# EAGLE design boden2021_V35 (EAGLE 9.6.1)
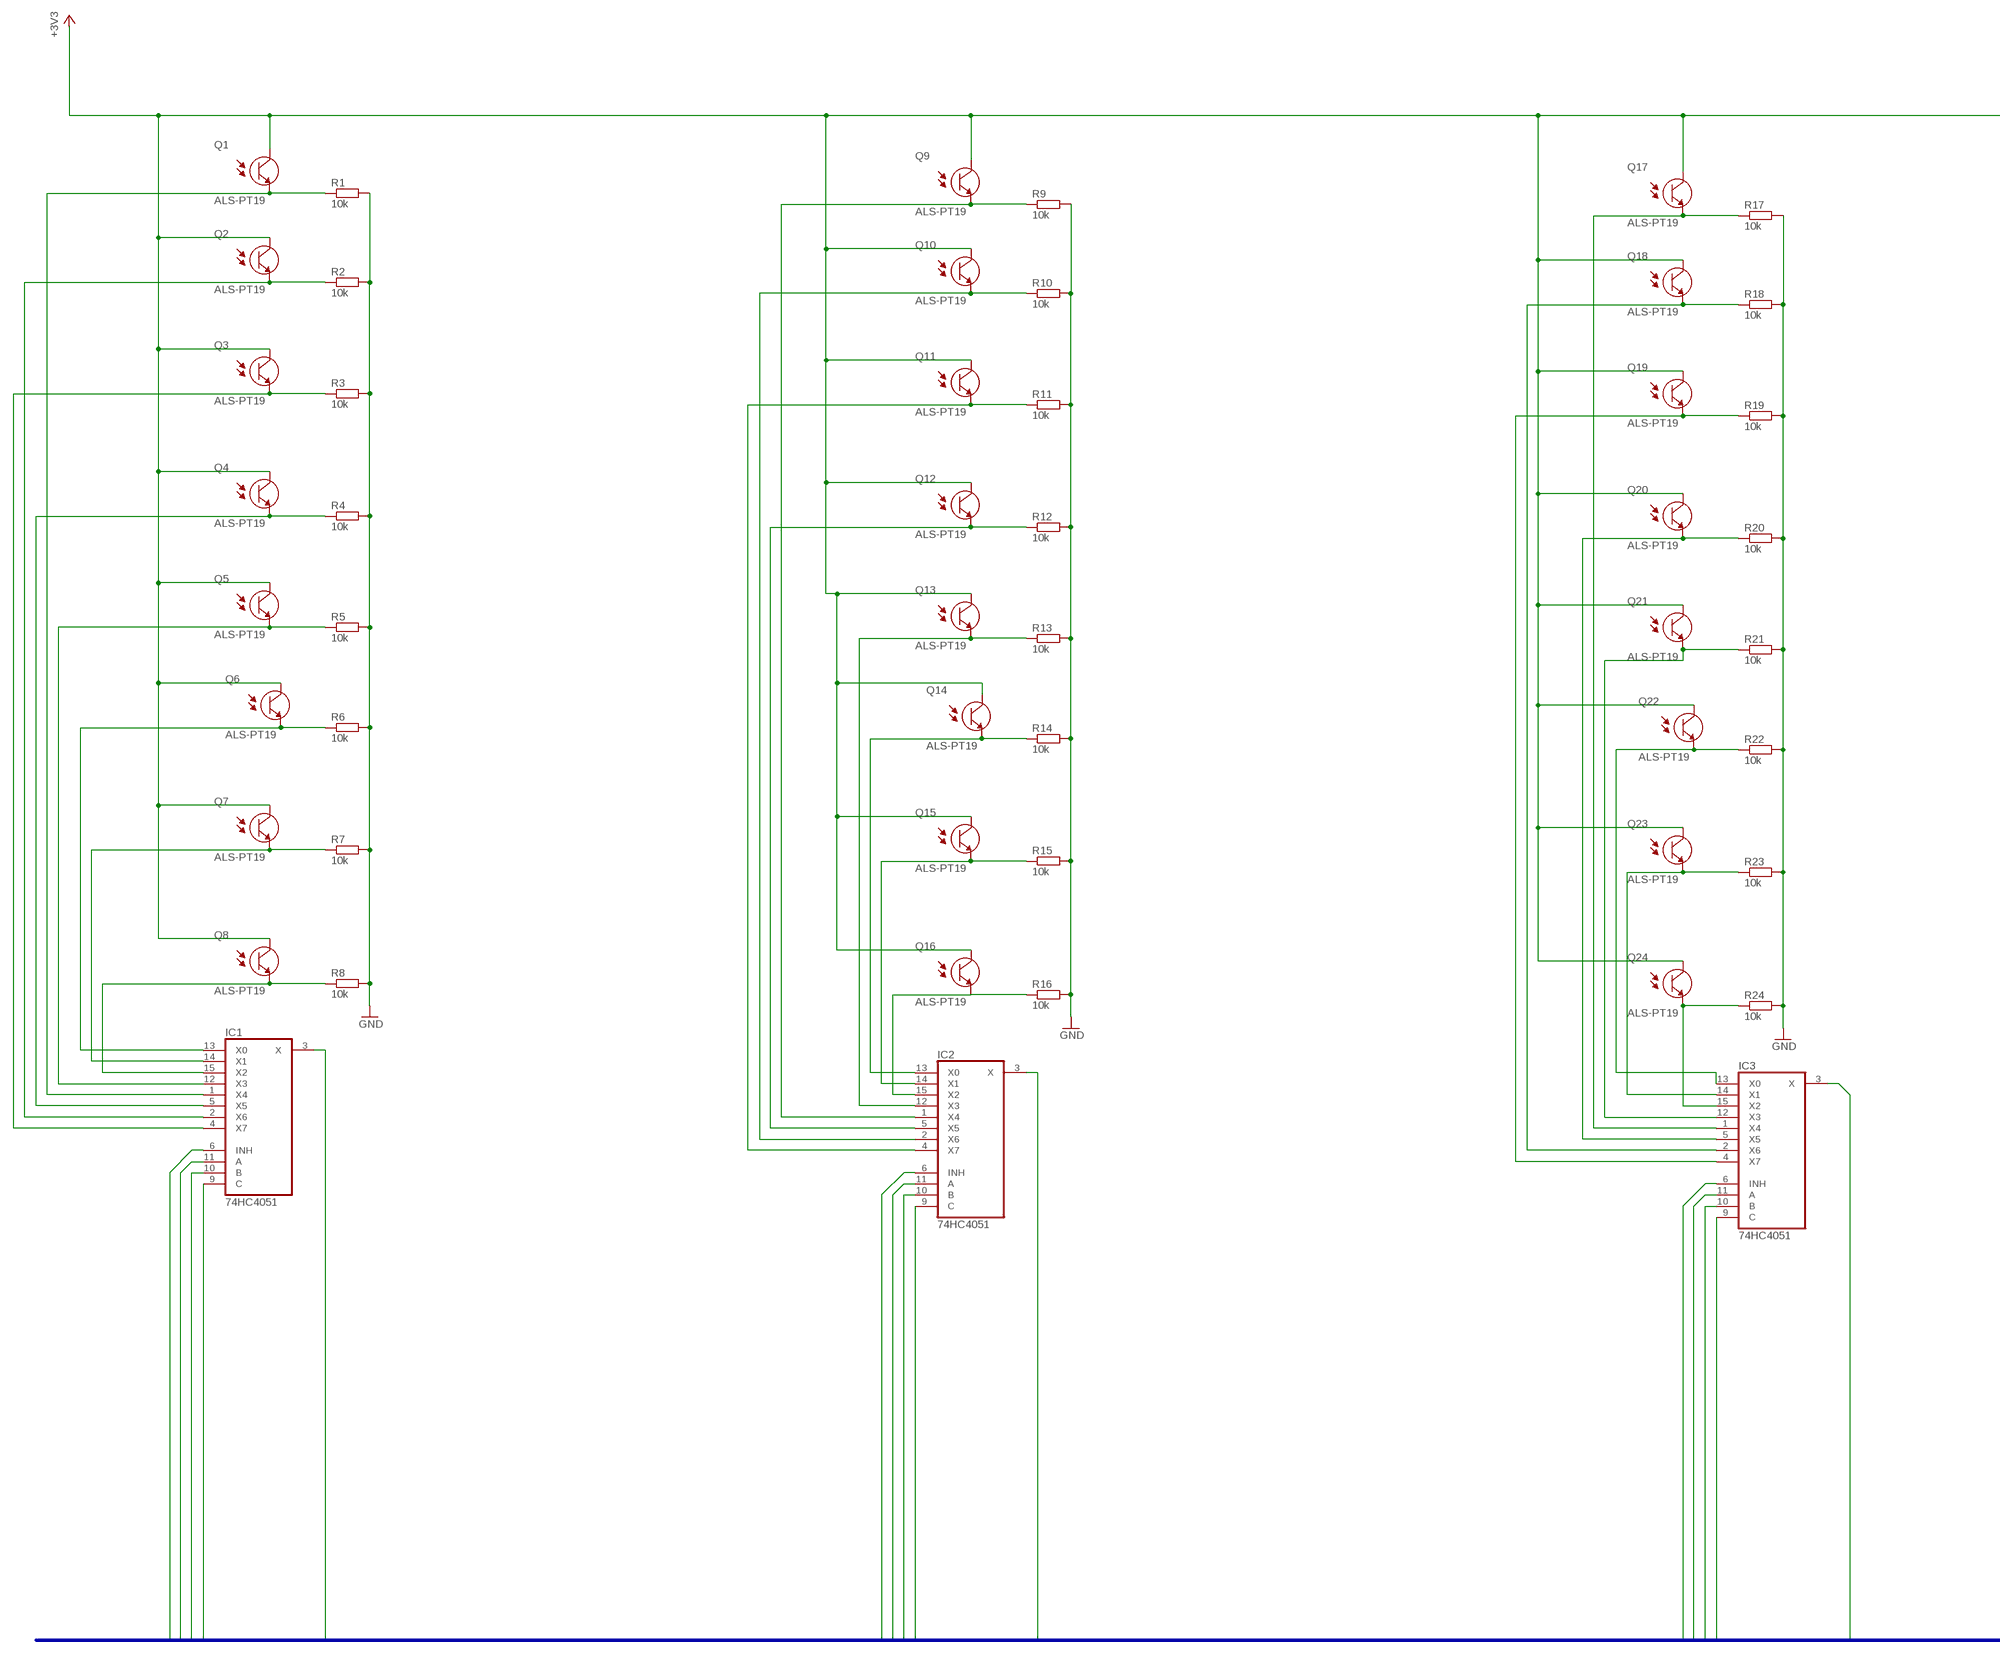
[diagram p0: schematic, sheet 1, part 1 of 3]
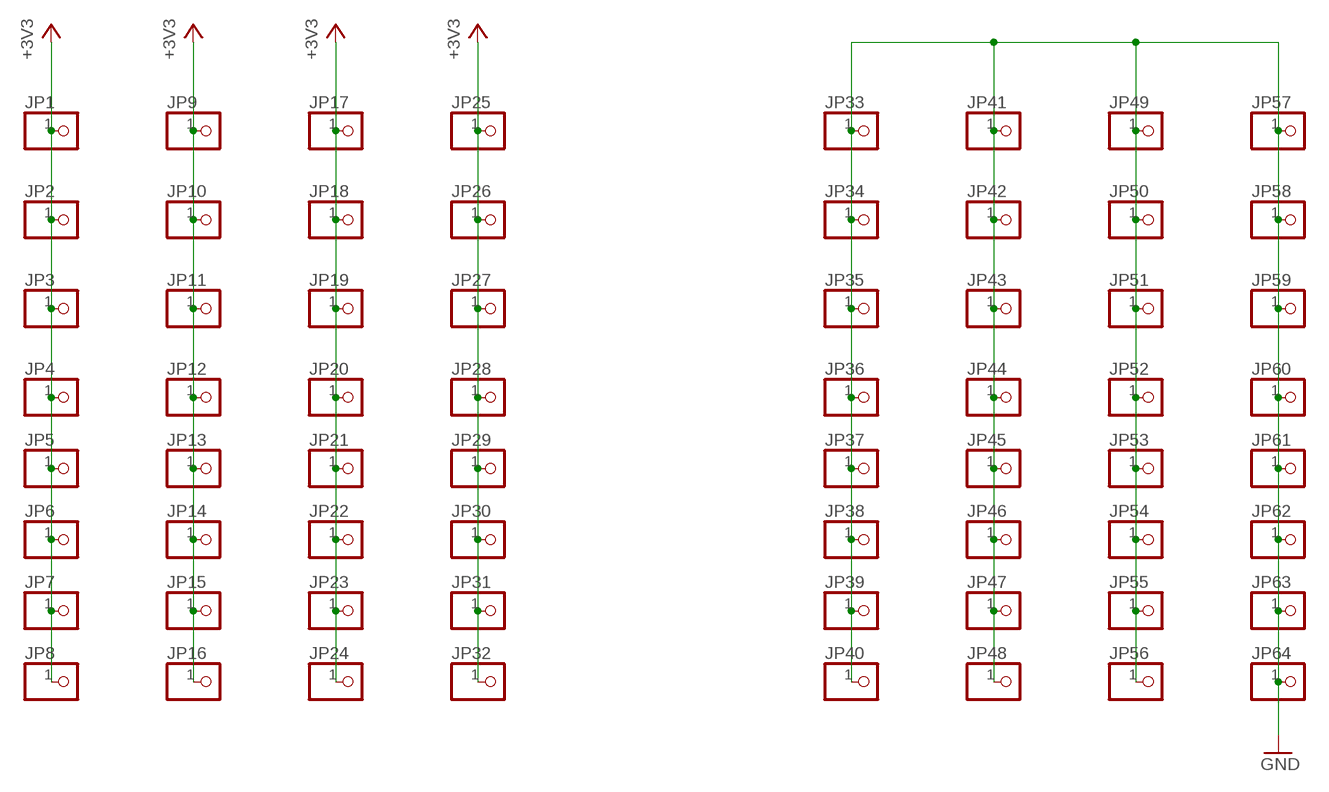
[diagram p1: schematic, sheet 1, part 2 of 3]
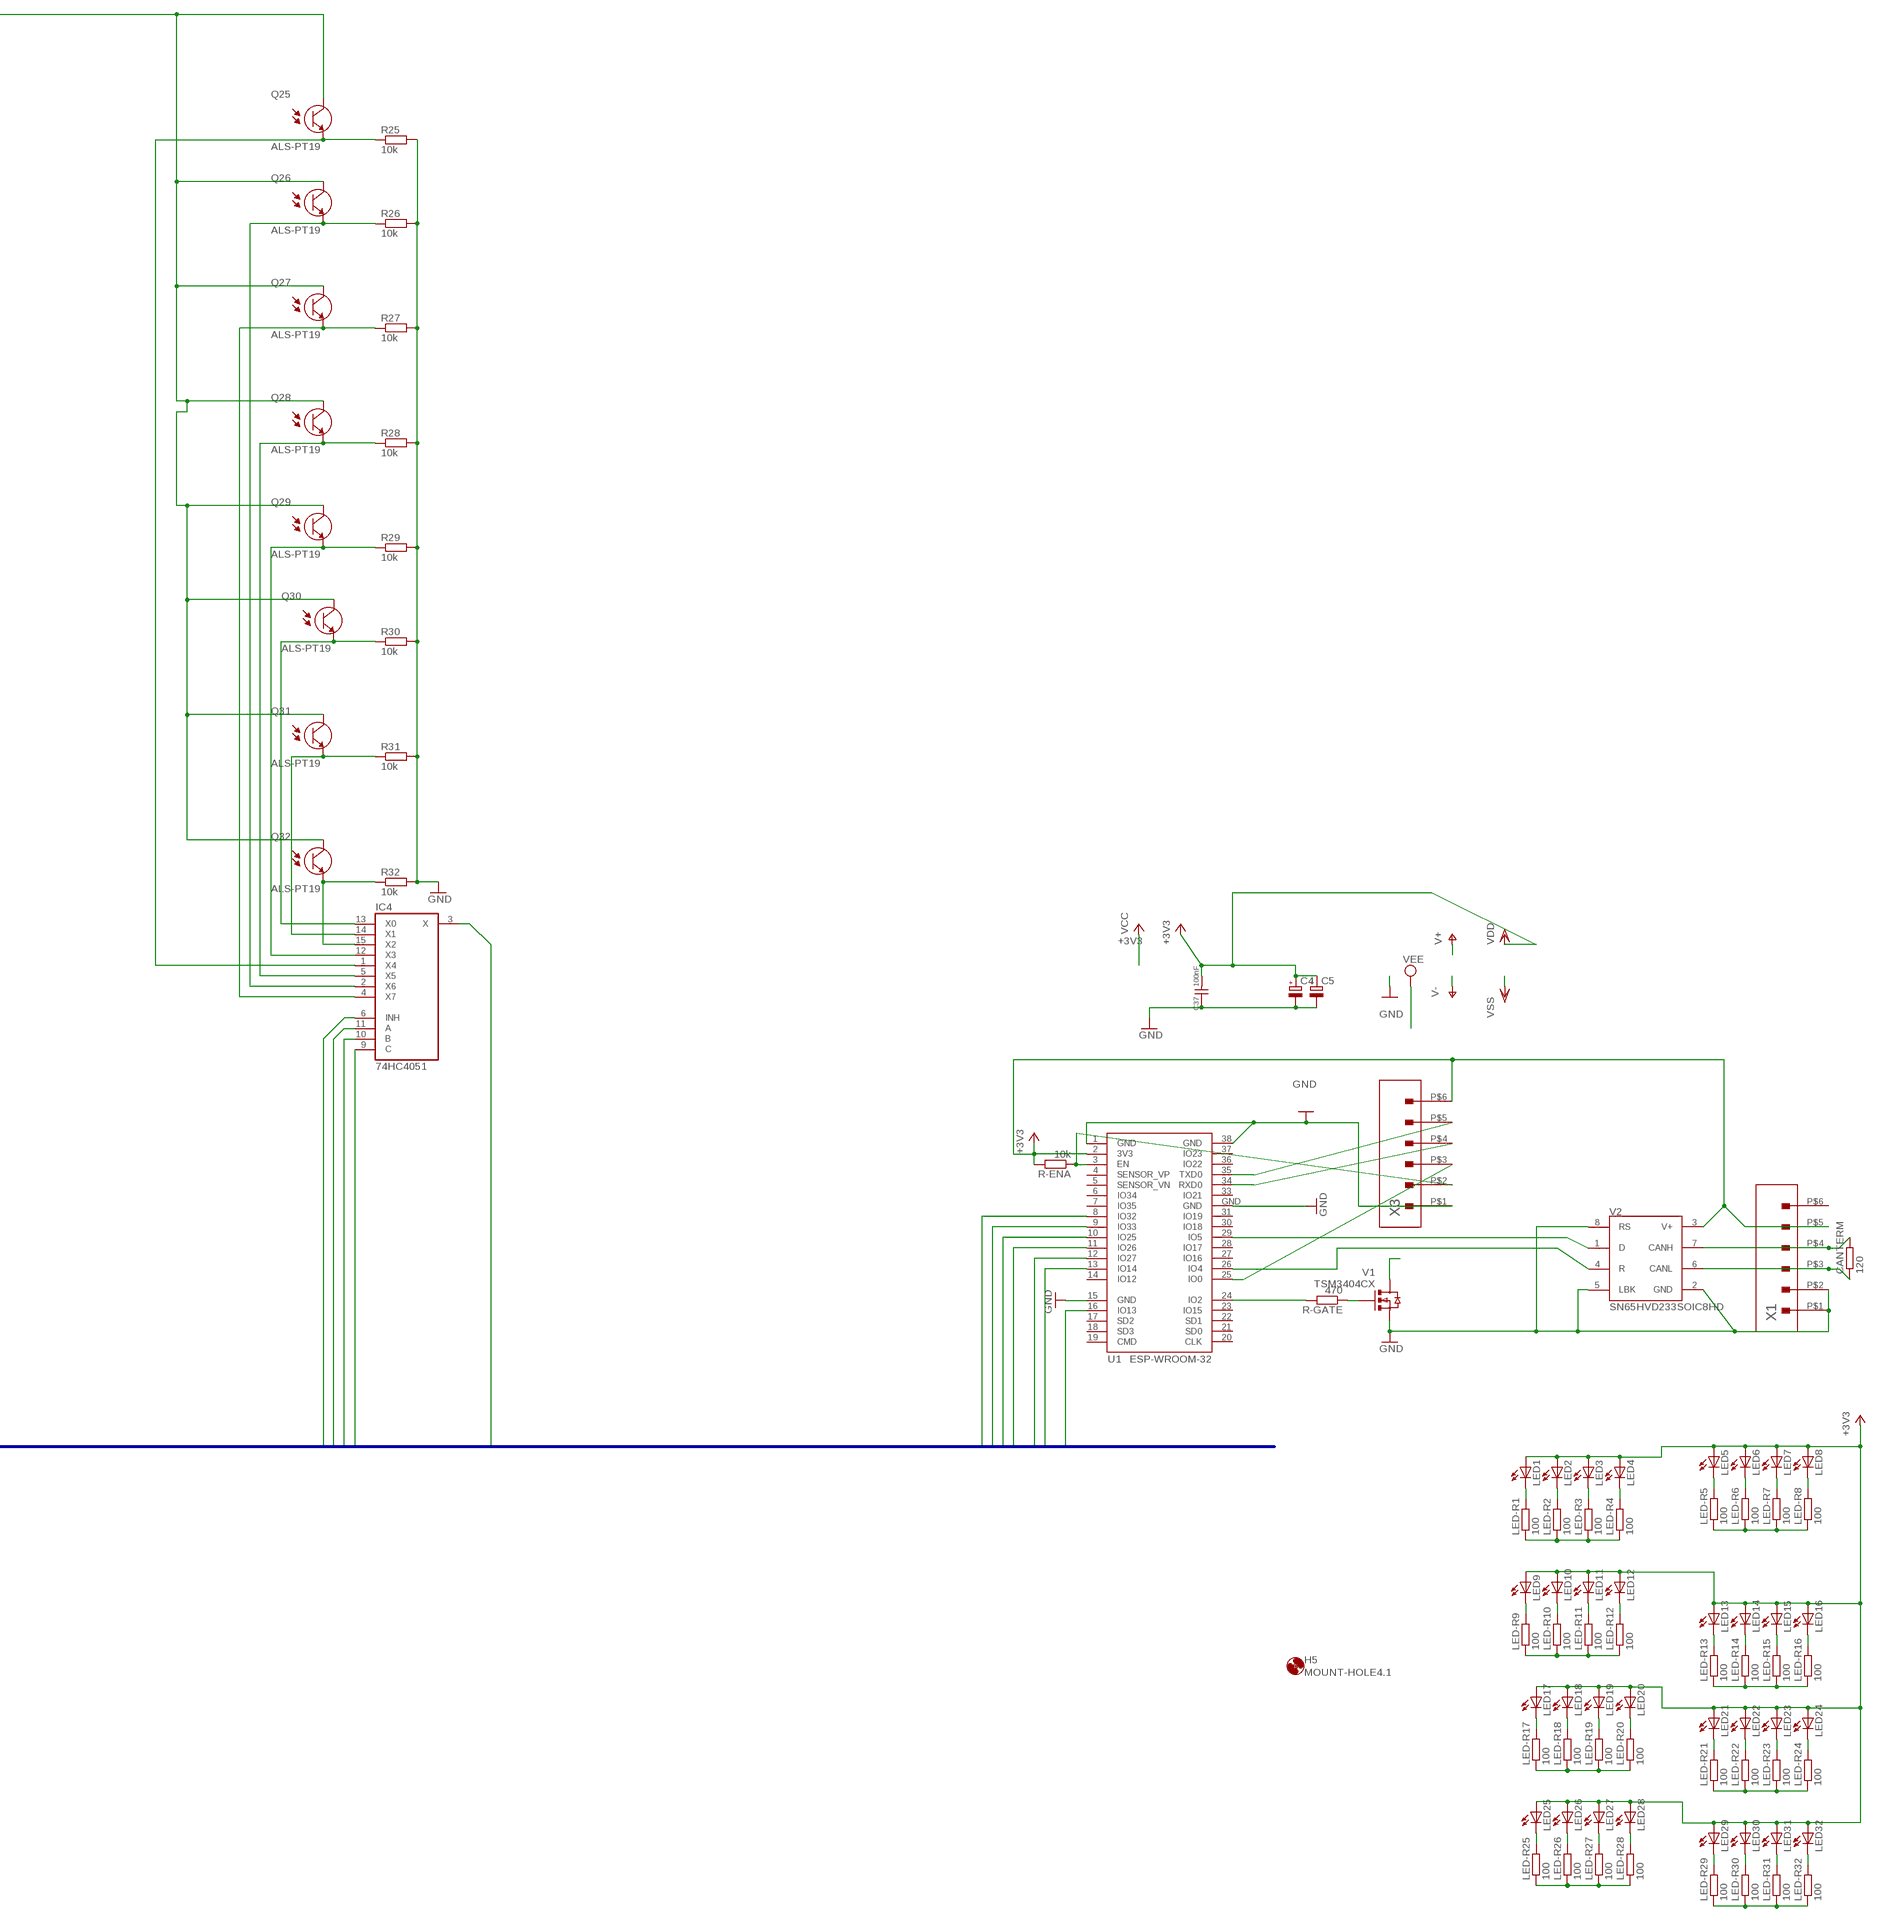
[diagram p2: schematic, sheet 1, part 3 of 3]

## Parts
C4  CPOL-EUE2,5-6E  [E2,5-6E]
C5  CPOL-EUE2,5-6E  [E2,5-6E]
C37  100nF  C0805  [0805]
CANTERM  120  R-EU_R0603  [R0603]
H5  MOUNT-HOLE4.1  [4,1]
IC1  74HC4051  4051  [TSSOP-16]
IC2  74HC4051  4051  [TSSOP-16]
IC3  74HC4051  4051  [TSSOP-16]
IC4  74HC4051  4051  [TSSOP-16]
JP1  PINHD-1X1  [1X01]
JP2  PINHD-1X1  [1X01]
JP3  PINHD-1X1  [1X01]
JP4  PINHD-1X1  [1X01]
JP5  PINHD-1X1  [1X01]
JP6  PINHD-1X1  [1X01]
JP7  PINHD-1X1  [1X01]
JP8  PINHD-1X1  [1X01]
JP9  PINHD-1X1  [1X01]
JP10  PINHD-1X1  [1X01]
JP11  PINHD-1X1  [1X01]
JP12  PINHD-1X1  [1X01]
JP13  PINHD-1X1  [1X01]
JP14  PINHD-1X1  [1X01]
JP15  PINHD-1X1  [1X01]
JP16  PINHD-1X1  [1X01]
JP17  PINHD-1X1  [1X01]
JP18  PINHD-1X1  [1X01]
JP19  PINHD-1X1  [1X01]
JP20  PINHD-1X1  [1X01]
JP21  PINHD-1X1  [1X01]
JP22  PINHD-1X1  [1X01]
JP23  PINHD-1X1  [1X01]
JP24  PINHD-1X1  [1X01]
JP25  PINHD-1X1  [1X01]
JP26  PINHD-1X1  [1X01]
JP27  PINHD-1X1  [1X01]
JP28  PINHD-1X1  [1X01]
JP29  PINHD-1X1  [1X01]
JP30  PINHD-1X1  [1X01]
JP31  PINHD-1X1  [1X01]
JP32  PINHD-1X1  [1X01]
JP33  PINHD-1X1  [1X01]
JP34  PINHD-1X1  [1X01]
JP35  PINHD-1X1  [1X01]
JP36  PINHD-1X1  [1X01]
JP37  PINHD-1X1  [1X01]
JP38  PINHD-1X1  [1X01]
JP39  PINHD-1X1  [1X01]
JP40  PINHD-1X1  [1X01]
JP41  PINHD-1X1  [1X01]
JP42  PINHD-1X1  [1X01]
JP43  PINHD-1X1  [1X01]
JP44  PINHD-1X1  [1X01]
JP45  PINHD-1X1  [1X01]
JP46  PINHD-1X1  [1X01]
JP47  PINHD-1X1  [1X01]
JP48  PINHD-1X1  [1X01]
JP49  PINHD-1X1  [1X01]
JP50  PINHD-1X1  [1X01]
JP51  PINHD-1X1  [1X01]
JP52  PINHD-1X1  [1X01]
JP53  PINHD-1X1  [1X01]
JP54  PINHD-1X1  [1X01]
JP55  PINHD-1X1  [1X01]
JP56  PINHD-1X1  [1X01]
JP57  PINHD-1X1  [1X01]
JP58  PINHD-1X1  [1X01]
JP59  PINHD-1X1  [1X01]
JP60  PINHD-1X1  [1X01]
JP61  PINHD-1X1  [1X01]
JP62  PINHD-1X1  [1X01]
JP63  PINHD-1X1  [1X01]
JP64  PINHD-1X1  [1X01]
LED1  LEDP-LCC-2  [P-LCC-2]
LED2  LEDP-LCC-2  [P-LCC-2]
LED3  LEDP-LCC-2  [P-LCC-2]
LED4  LEDP-LCC-2  [P-LCC-2]
LED5  LEDP-LCC-2  [P-LCC-2]
LED6  LEDP-LCC-2  [P-LCC-2]
LED7  LEDP-LCC-2  [P-LCC-2]
LED8  LEDP-LCC-2  [P-LCC-2]
LED9  LEDP-LCC-2  [P-LCC-2]
LED10  LEDP-LCC-2  [P-LCC-2]
LED11  LEDP-LCC-2  [P-LCC-2]
LED12  LEDP-LCC-2  [P-LCC-2]
LED13  LEDP-LCC-2  [P-LCC-2]
LED14  LEDP-LCC-2  [P-LCC-2]
LED15  LEDP-LCC-2  [P-LCC-2]
LED16  LEDP-LCC-2  [P-LCC-2]
LED17  LEDP-LCC-2  [P-LCC-2]
LED18  LEDP-LCC-2  [P-LCC-2]
LED19  LEDP-LCC-2  [P-LCC-2]
LED20  LEDP-LCC-2  [P-LCC-2]
LED21  LEDP-LCC-2  [P-LCC-2]
LED22  LEDP-LCC-2  [P-LCC-2]
LED23  LEDP-LCC-2  [P-LCC-2]
LED24  LEDP-LCC-2  [P-LCC-2]
LED25  LEDP-LCC-2  [P-LCC-2]
LED26  LEDP-LCC-2  [P-LCC-2]
LED27  LEDP-LCC-2  [P-LCC-2]
LED28  LEDP-LCC-2  [P-LCC-2]
LED29  LEDP-LCC-2  [P-LCC-2]
LED30  LEDP-LCC-2  [P-LCC-2]
LED31  LEDP-LCC-2  [P-LCC-2]
LED32  LEDP-LCC-2  [P-LCC-2]
LED-R1  100  R-EU_R0805  [R0805]
LED-R2  100  R-EU_R0805  [R0805]
LED-R3  100  R-EU_R0805  [R0805]
LED-R4  100  R-EU_R0805  [R0805]
LED-R5  100  R-EU_R0805  [R0805]
LED-R6  100  R-EU_R0805  [R0805]
LED-R7  100  R-EU_R0805  [R0805]
LED-R8  100  R-EU_R0805  [R0805]
LED-R9  100  R-EU_R0805  [R0805]
LED-R10  100  R-EU_R0805  [R0805]
LED-R11  100  R-EU_R0805  [R0805]
LED-R12  100  R-EU_R0805  [R0805]
LED-R13  100  R-EU_R0805  [R0805]
LED-R14  100  R-EU_R0805  [R0805]
LED-R15  100  R-EU_R0805  [R0805]
LED-R16  100  R-EU_R0805  [R0805]
LED-R17  100  R-EU_R0805  [R0805]
LED-R18  100  R-EU_R0805  [R0805]
LED-R19  100  R-EU_R0805  [R0805]
LED-R20  100  R-EU_R0805  [R0805]
LED-R21  100  R-EU_R0805  [R0805]
LED-R22  100  R-EU_R0805  [R0805]
LED-R23  100  R-EU_R0805  [R0805]
LED-R24  100  R-EU_R0805  [R0805]
LED-R25  100  R-EU_R0805  [R0805]
LED-R26  100  R-EU_R0805  [R0805]
LED-R27  100  R-EU_R0805  [R0805]
LED-R28  100  R-EU_R0805  [R0805]
LED-R29  100  R-EU_R0805  [R0805]
LED-R30  100  R-EU_R0805  [R0805]
LED-R31  100  R-EU_R0805  [R0805]
LED-R32  100  R-EU_R0805  [R0805]
Q1  ALS-PT19  [ALSPT19315CL177TR8]
Q2  ALS-PT19  [ALSPT19315CL177TR8]
Q3  ALS-PT19  [ALSPT19315CL177TR8]
Q4  ALS-PT19  [ALSPT19315CL177TR8]
Q5  ALS-PT19  [ALSPT19315CL177TR8]
Q6  ALS-PT19  [ALSPT19315CL177TR8]
Q7  ALS-PT19  [ALSPT19315CL177TR8]
Q8  ALS-PT19  [ALSPT19315CL177TR8]
Q9  ALS-PT19  [ALSPT19315CL177TR8]
Q10  ALS-PT19  [ALSPT19315CL177TR8]
Q11  ALS-PT19  [ALSPT19315CL177TR8]
Q12  ALS-PT19  [ALSPT19315CL177TR8]
Q13  ALS-PT19  [ALSPT19315CL177TR8]
Q14  ALS-PT19  [ALSPT19315CL177TR8]
Q15  ALS-PT19  [ALSPT19315CL177TR8]
Q16  ALS-PT19  [ALSPT19315CL177TR8]
Q17  ALS-PT19  [ALSPT19315CL177TR8]
Q18  ALS-PT19  [ALSPT19315CL177TR8]
Q19  ALS-PT19  [ALSPT19315CL177TR8]
Q20  ALS-PT19  [ALSPT19315CL177TR8]
Q21  ALS-PT19  [ALSPT19315CL177TR8]
Q22  ALS-PT19  [ALSPT19315CL177TR8]
Q23  ALS-PT19  [ALSPT19315CL177TR8]
Q24  ALS-PT19  [ALSPT19315CL177TR8]
Q25  ALS-PT19  [ALSPT19315CL177TR8]
Q26  ALS-PT19  [ALSPT19315CL177TR8]
Q27  ALS-PT19  [ALSPT19315CL177TR8]
Q28  ALS-PT19  [ALSPT19315CL177TR8]
Q29  ALS-PT19  [ALSPT19315CL177TR8]
Q30  ALS-PT19  [ALSPT19315CL177TR8]
Q31  ALS-PT19  [ALSPT19315CL177TR8]
Q32  ALS-PT19  [ALSPT19315CL177TR8]
R1  10k  R-EU_R0603  [R0603]
R2  10k  R-EU_R0603  [R0603]
R3  10k  R-EU_R0603  [R0603]
R4  10k  R-EU_R0603  [R0603]
R5  10k  R-EU_R0603  [R0603]
R6  10k  R-EU_R0603  [R0603]
R7  10k  R-EU_R0603  [R0603]
R8  10k  R-EU_R0603  [R0603]
R9  10k  R-EU_R0603  [R0603]
R10  10k  R-EU_R0603  [R0603]
R11  10k  R-EU_R0603  [R0603]
R12  10k  R-EU_R0603  [R0603]
R13  10k  R-EU_R0603  [R0603]
R14  10k  R-EU_R0603  [R0603]
R15  10k  R-EU_R0603  [R0603]
R16  10k  R-EU_R0603  [R0603]
R17  10k  R-EU_R0603  [R0603]
R18  10k  R-EU_R0603  [R0603]
R19  10k  R-EU_R0603  [R0603]
R20  10k  R-EU_R0603  [R0603]
R21  10k  R-EU_R0603  [R0603]
R22  10k  R-EU_R0603  [R0603]
R23  10k  R-EU_R0603  [R0603]
R24  10k  R-EU_R0603  [R0603]
R25  10k  R-EU_R0603  [R0603]
R26  10k  R-EU_R0603  [R0603]
R27  10k  R-EU_R0603  [R0603]
R28  10k  R-EU_R0603  [R0603]
R29  10k  R-EU_R0603  [R0603]
R30  10k  R-EU_R0603  [R0603]
R31  10k  R-EU_R0603  [R0603]
R32  10k  R-EU_R0603  [R0603]
R-ENA  10k  R-EU_R0603  [R0603]
R-GATE  470  R-EU_R0603  [R0603]
U1  ESP-WROOM-32  [ESP-WROOM-32]
V1  TSM3404CX  [SOT23]
V2  SN65HVD233SOIC8HD  [SO08]
X1  MOLEX104078-0610  [MOLEX104078-0610]
X3  MOLEX104078-0610  [MOLEX104078-0610]

## Nets
+3V3: C4.+ C5.+ C37.1 JP1.1 JP2.1 JP3.1 JP4.1 JP5.1 JP6.1 JP7.1 JP8.1 JP9.1 JP10.1 JP11.1 JP12.1 JP13.1 JP14.1 JP15.1 JP16.1 JP17.1 JP18.1 JP19.1 JP20.1 JP21.1 JP22.1 JP23.1 JP24.1 JP25.1 JP26.1 JP27.1 JP28.1 JP29.1 JP30.1 JP31.1 JP32.1 LED1.A LED2.A LED3.A LED4.A LED5.A LED6.A LED7.A LED8.A LED9.A LED10.A LED11.A LED12.A LED13.A LED14.A LED15.A LED16.A LED17.A LED18.A LED19.A LED20.A LED21.A LED22.A LED23.A LED24.A LED25.A LED26.A LED27.A LED28.A LED29.A LED30.A LED31.A LED32.A Q1.1(C) Q2.1(C) Q3.1(C) Q4.1(C) Q5.1(C) Q6.1(C) Q7.1(C) Q8.1(C) Q9.1(C) Q10.1(C) Q11.1(C) Q12.1(C) Q13.1(C) Q14.1(C) Q15.1(C) Q16.1(C) Q17.1(C) Q18.1(C) Q19.1(C) Q20.1(C) Q21.1(C) Q22.1(C) Q23.1(C) Q24.1(C) Q25.1(C) Q26.1(C) Q27.1(C) Q28.1(C) Q29.1(C) Q30.1(C) Q31.1(C) Q32.1(C) R-ENA.2 U1.2(3V3) V2.3(V+) X1.P$5 X3.P$6 ; supply symbol labelled VDD, V+, VCC
A1: IC1.9(C) IC2.9(C) IC3.9(C) IC4.9(C) U1.16(IO13)
A2: IC1.10(B) IC2.10(B) IC3.10(B) IC4.10(B) U1.12(IO27)
A3: IC1.11(A) IC2.11(A) IC3.11(A) IC4.11(A) U1.13(IO14)
D1: IC2.3(X) U1.8(IO32)
D2: IC1.3(X) U1.9(IO33)
D3: IC3.3(X) U1.10(IO25)
D4: IC4.3(X) U1.11(IO26)
GND: C4.- C5.- C37.2 IC1.6(INH) IC2.6(INH) IC3.6(INH) IC4.6(INH) JP33.1 JP34.1 JP35.1 JP36.1 JP37.1 JP38.1 JP39.1 JP40.1 JP41.1 JP42.1 JP43.1 JP44.1 JP45.1 JP46.1 JP47.1 JP48.1 JP49.1 JP50.1 JP51.1 JP52.1 JP53.1 JP54.1 JP55.1 JP56.1 JP57.1 JP58.1 JP59.1 JP60.1 JP61.1 JP62.1 JP63.1 JP64.1 R1.2 R2.2 R3.2 R4.2 R5.2 R6.2 R7.2 R8.2 R9.2 R10.2 R11.2 R12.2 R13.2 R14.2 R15.2 R16.2 R17.2 R18.2 R19.2 R20.2 R21.2 R22.2 R23.2 R24.2 R25.2 R26.2 R27.2 R28.2 R29.2 R30.2 R31.2 R32.2 U1.1(GND) U1.15(GND) U1.38(GND) U1.GND V1.S V2.2(GND) V2.5(LBK) V2.8(RS) X1.P$1 X1.P$2 X3.P$1 ; supply symbol labelled V-, VSS, VEE
LED: LED-R1.1 LED-R2.1 LED-R3.1 LED-R4.1 LED-R5.1 LED-R6.1 LED-R7.1 LED-R8.1 LED-R9.1 LED-R10.1 LED-R11.1 LED-R12.1 LED-R13.1 LED-R14.1 LED-R15.1 LED-R16.1 LED-R17.1 LED-R18.1 LED-R19.1 LED-R20.1 LED-R21.1 LED-R22.1 LED-R23.1 LED-R24.1 LED-R25.1 LED-R26.1 LED-R27.1 LED-R28.1 LED-R29.1 LED-R30.1 LED-R31.1 LED-R32.1 V1.D
LED-BASE: R-GATE.1 V1.G
LED-SCHALT: R-GATE.2 U1.24(IO2)
N$1: LED5.C LED-R5.2
N$2: LED6.C LED-R6.2
N$3: LED7.C LED-R7.2
N$4: LED8.C LED-R8.2
N$5: LED9.C LED-R9.2
N$6: LED10.C LED-R10.2
N$7: LED11.C LED-R11.2
N$8: LED12.C LED-R12.2
N$9: LED1.C LED-R1.2
N$10: LED2.C LED-R2.2
N$11: LED3.C LED-R3.2
N$12: LED4.C LED-R4.2
N$13: LED13.C LED-R13.2
N$14: LED14.C LED-R14.2
N$15: LED15.C LED-R15.2
N$16: LED16.C LED-R16.2
N$17: LED17.C LED-R17.2
N$18: LED18.C LED-R18.2
N$19: LED19.C LED-R19.2
N$20: LED20.C LED-R20.2
N$21: LED21.C LED-R21.2
N$22: LED22.C LED-R22.2
N$23: LED23.C LED-R23.2
N$24: LED24.C LED-R24.2
N$25: LED25.C LED-R25.2
N$26: LED26.C LED-R26.2
N$27: LED27.C LED-R27.2
N$28: LED28.C LED-R28.2
N$29: LED29.C LED-R29.2
N$30: LED30.C LED-R30.2
N$31: LED31.C LED-R31.2
N$32: LED32.C LED-R32.2
N$33: R-ENA.1 U1.3(EN) X3.P$2
N$34: IC1.13(X0) Q6.2(E) R6.1
N$35: U1.25(IO0) X3.P$3
N$36: IC3.14(X1) Q23.2(E) R23.1
N$37: IC3.13(X0) Q22.2(E) R22.1
N$38: IC1.12(X3) Q5.2(E) R5.1
N$39: IC1.14(X1) Q7.2(E) R7.1
N$40: IC1.15(X2) Q8.2(E) R8.1
N$41: IC3.12(X3) Q21.2(E) R21.1
N$42: IC4.4(X7) Q27.2(E) R27.1
N$43: IC1.1(X4) Q1.2(E) R1.1
N$44: IC1.5(X5) Q4.2(E) R4.1
N$45: IC1.2(X6) Q2.2(E) R2.1
N$46: IC1.4(X7) Q3.2(E) R3.1
N$47: IC2.15(X2) Q16.2(E) R16.1
N$48: IC2.14(X1) Q15.2(E) R15.1
N$49: IC2.13(X0) Q14.2(E) R14.1
N$50: IC2.12(X3) Q13.2(E) R13.1
N$51: IC2.1(X4) Q9.2(E) R9.1
N$52: IC2.5(X5) Q12.2(E) R12.1
N$53: IC2.4(X7) Q11.2(E) R11.1
N$54: IC2.2(X6) Q10.2(E) R10.1
N$55: IC3.15(X2) Q24.2(E) R24.1
N$56: IC4.2(X6) Q26.2(E) R26.1
N$58: IC3.1(X4) Q17.2(E) R17.1
N$59: IC3.5(X5) Q20.2(E) R20.1
N$60: IC3.2(X6) Q18.2(E) R18.1
N$61: IC3.4(X7) Q19.2(E) R19.1
N$62: IC4.15(X2) Q32.2(E) R32.1
N$63: IC4.14(X1) Q31.2(E) R31.1
N$64: IC4.13(X0) Q30.2(E) R30.1
N$65: IC4.12(X3) Q29.2(E) R29.1
N$66: IC4.1(X4) Q25.2(E) R25.1
N$67: IC4.5(X5) Q28.2(E) R28.1
N$99: U1.26(IO4) V2.4(R)
N$100: U1.29(IO5) V2.1(D)
N$101: CANTERM.2 V2.7(CANH) X1.P$4
N$102: CANTERM.1 V2.6(CANL) X1.P$3
RX: U1.34(RXD0) X3.P$4
TX: U1.35(TXD0) X3.P$5
Unconnected: U1.4(SENSOR_VP) U1.5(SENSOR_VN) U1.6(IO34) U1.7(IO35) U1.14(IO12) U1.17(SD2) U1.18(SD3) U1.19(CMD) U1.20(CLK) U1.21(SD0) U1.22(SD1) U1.23(IO15) U1.27(IO16) U1.28(IO17) U1.30(IO18) U1.31(IO19) U1.33(IO21) U1.36(IO22) U1.37(IO23) X1.P$6

## Buses
A1,A2,A3,D1,D2,D3,D4,D5,D6,D7,D8,GND

## Power pins joined to a net without a drawn wire
+3V3: IC1.16(VCC) IC2.16(VCC) IC3.16(VCC) IC4.16(VCC)
GND: IC1.7(VEE) IC1.8(GND) IC2.7(VEE) IC2.8(GND) IC3.7(VEE) IC3.8(GND) IC4.7(VEE) IC4.8(GND)

## Library data of the parts
C4 C5 = rcl:CPOL-EU: POLARIZED CAPACITOR, European symbol; SPICEPREFIX: C
C37 = KONDENSA:C0805
CANTERM LED-R1-LED-R32 = rcl:R-EU_: RESISTOR, European symbol
H5 = holes:MOUNT-HOLE: MOUNTING HOLE with drill center marker
IC1-IC4 = my40xx:4051: 8-channel ANALOG MULTIPLEXER
JP1-JP64 = pinhead:PINHD-1X1: PIN HEADER
LED1-LED32 = led:LED: LED OSRAM: - CHIPLED LG R971, LG N971, LY N971, LG Q971, LY Q971, LO R971, LY R971 LH N974, LH R974 LS Q976, LO Q976, LY Q976 LO Q996 - Hyper CHIPLED LW Q18S LB Q993, LB Q99A, LB R99A - SideLED LS A670, LO A670, LY A670, LG A670, LP A670 LB A673, LV A673, LT A673, LW A673 LH A674 LY A675 LS A676, LA A676, LO A676, LY A676, LW A676 LS A679, LY A679, LG A679 - Hyper Micro SIDELED® LS Y876, LA Y876, LO Y876, LY Y876 LT Y87S - SmartLED LW L88C, LW L88S LB L89C, LB L89S, LG L890 LS L89K, LO L89K, LY L89K LS L896, LA L896, LO L896, LY L896 - TOPLED LS T670, LO T670, LY T670, LG T670, LP T670 LSG T670, LSP T670, LSY T670, LOP T670, LYG T670 LG T671, LOG T671, LSG T671 LB T673, LV T673, LT T673, LW T673 LH T674 LS T676, LA T676, LO T676, LY T676, LB T676, LH T676, LSB T676, LW T676 LB T67C, LV T67C, LT T67C, LS T67K, LO T67K, LY T67K, LW E67C LS E67B, LA E67B, LO E67B, LY E67B, LB E67C, LV E67C, LT E67C LW T67C LS T679, LY T679, LG T679 LS T770, LO T770, LY T770, LG T770, LP T770 LB T773, LV T773, LT T773, LW T773 LH T774 LS E675, LA E675, LY E675, LS T675 LS T776, LA T776, LO T776, LY T776, LB T776 LHGB T686 LT T68C, LB T68C - Hyper Mini TOPLED® LB M676 - Mini TOPLED Santana® LG M470 LS M47K, LO M47K, LY M47K Source: http://www.osram.convergy.de LUXEON: - LUMILED® LXK2-PW12-R00, LXK2-PW12-S00, LXK2-PW14-U00, LXK2-PW14-V00 LXK2-PM12-R00, LXK2-PM12-S00, LXK2-PM14-U00 LXK2-PE12-Q00, LXK2-PE12-R00, LXK2-PE12-S00, LXK2-PE14-T00, LXK2-PE14-U00 LXK2-PB12-K00, LXK2-PB12-L00, LXK2-PB12-M00, LXK2-PB14-N00, LXK2-PB14-P00, LXK2-PB14-Q00 LXK2-PR12-L00, LXK2-PR12-M00, LXK2-PR14-Q00, LXK2-PR14-R00 LXK2-PD12-Q00, LXK2-PD12-R00, LXK2-PD12-S00 LXK2-PH12-R00, LXK2-PH12-S00 LXK2-PL12-P00, LXK2-PL12-Q00, LXK2-PL12-R00 Source: www.luxeon.com KINGBRIGHT: KA-3528ASYC Source: www.kingbright.com
Q1-Q32 = als-pt19_stie:ALS-PT19
R1-R32 R-GATE = rcl:R-EU_: RESISTOR, European symbol; SPICEPREFIX: R
R-ENA = rcl@1:R-EU_: RESISTOR, European symbol; SPICEPREFIX: R
U1 = esp32:ESP-WROOM-32: Espressif Systems ESP-WROOM-32
V1 = Mos_smd:TSM3404CX: N-Channel, 30V, 5,8A, 0,028R, Gate: 3V
V2 = Treiber:SN65HVD233: CAN Transceiver, 3,3V
X1 X3 = Roboter:MOLEX104078-0610

## Board
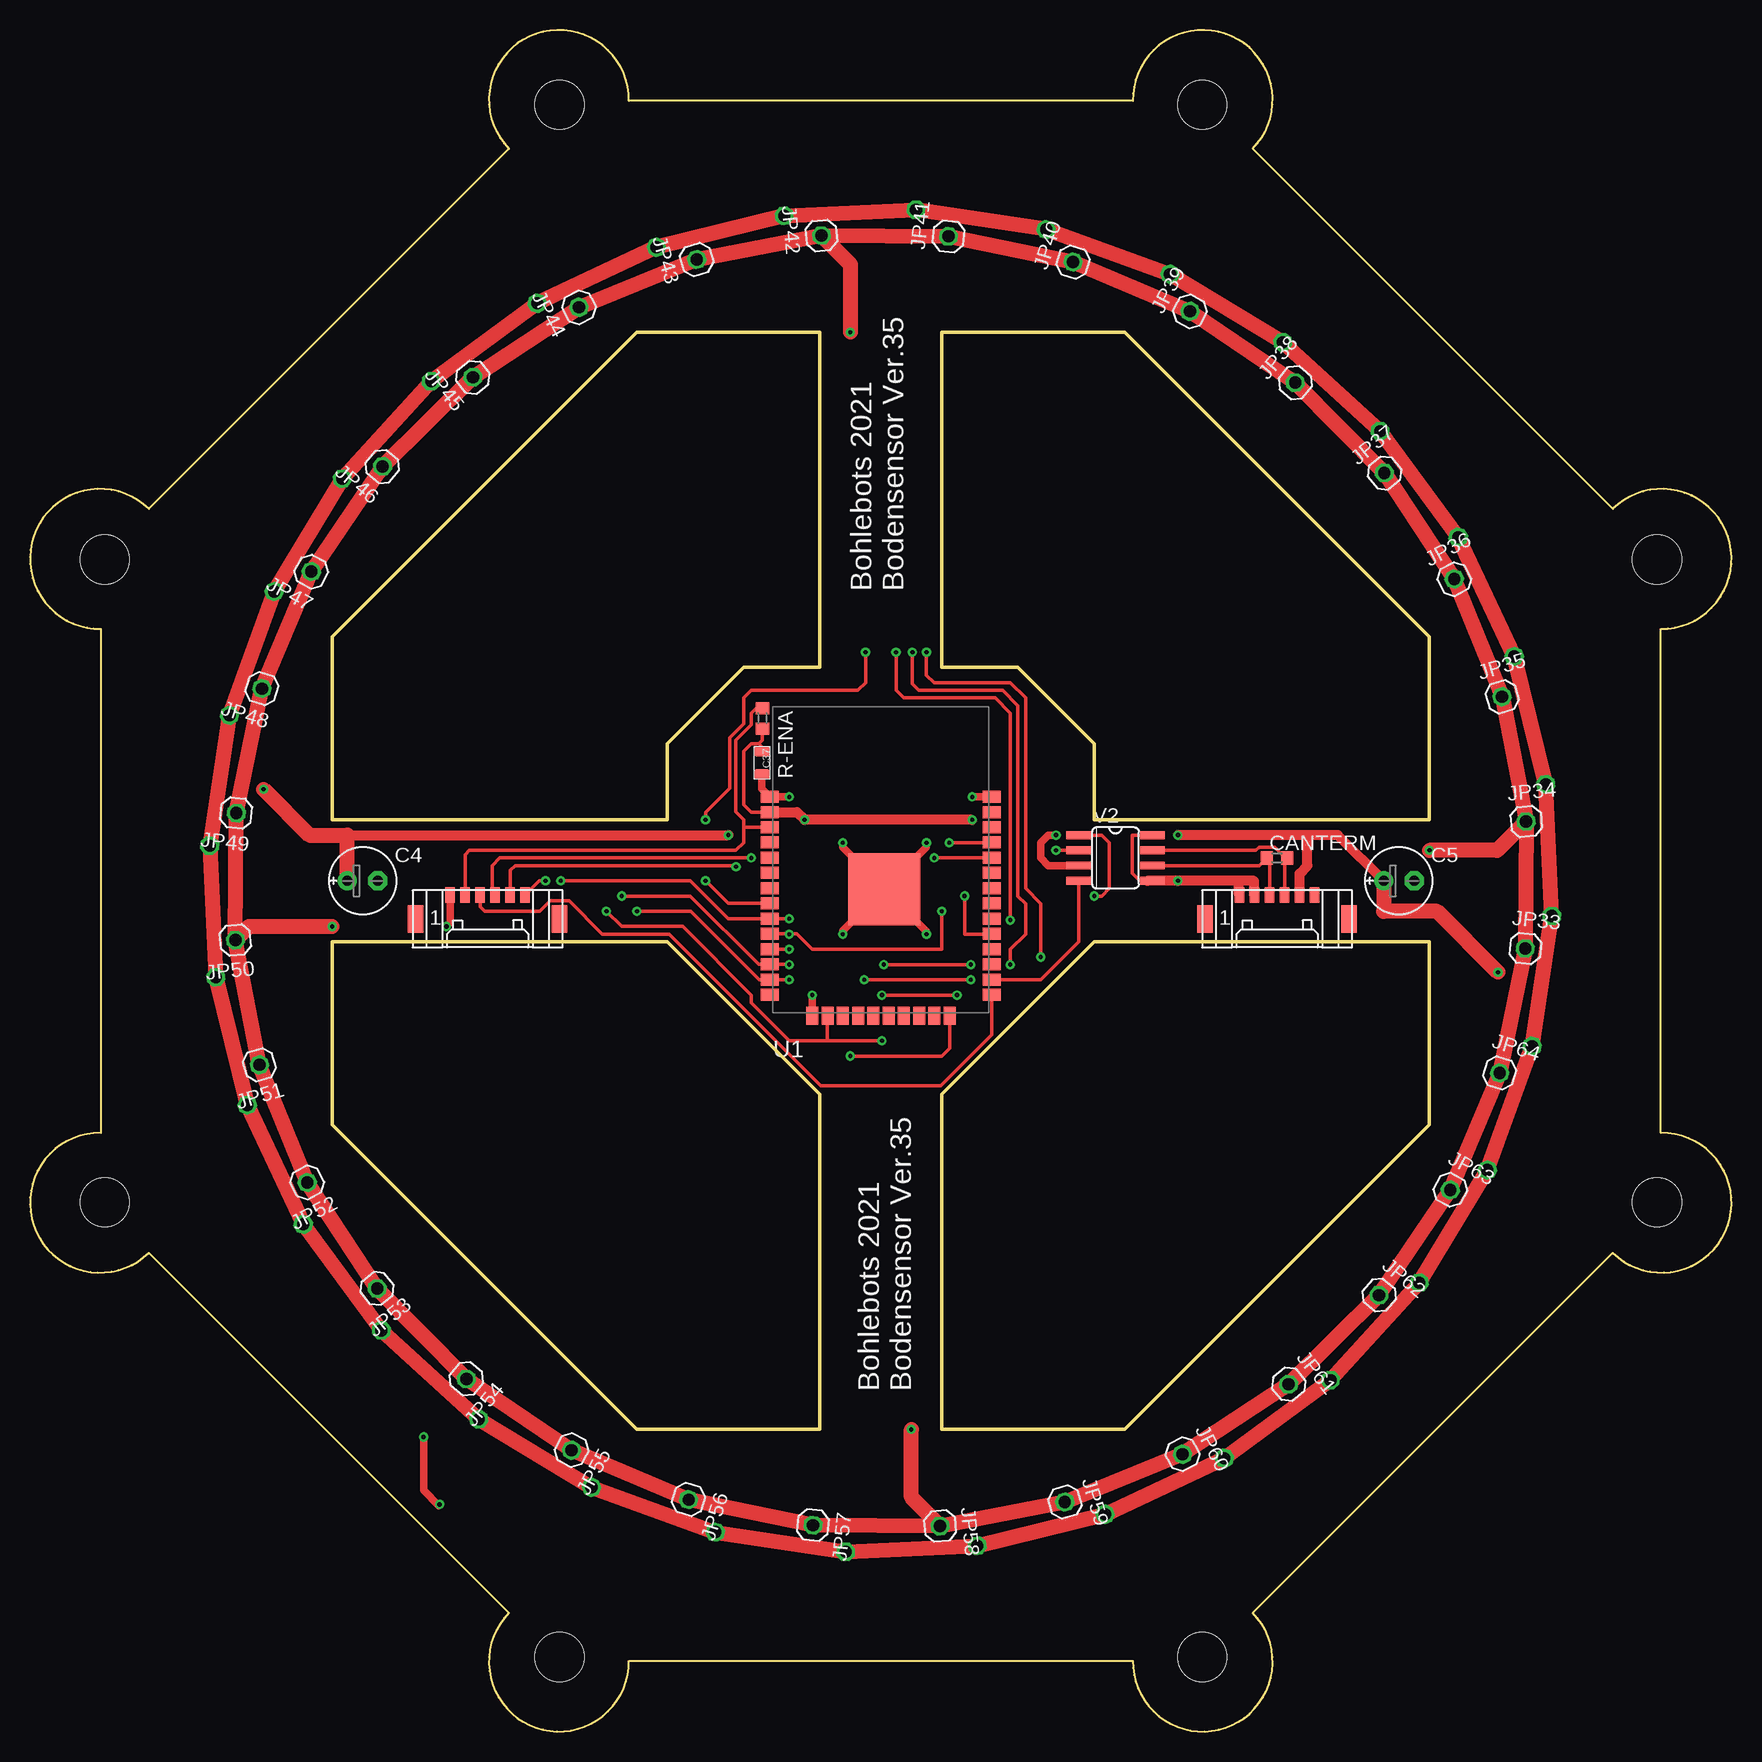
[diagram p3: board, top side]
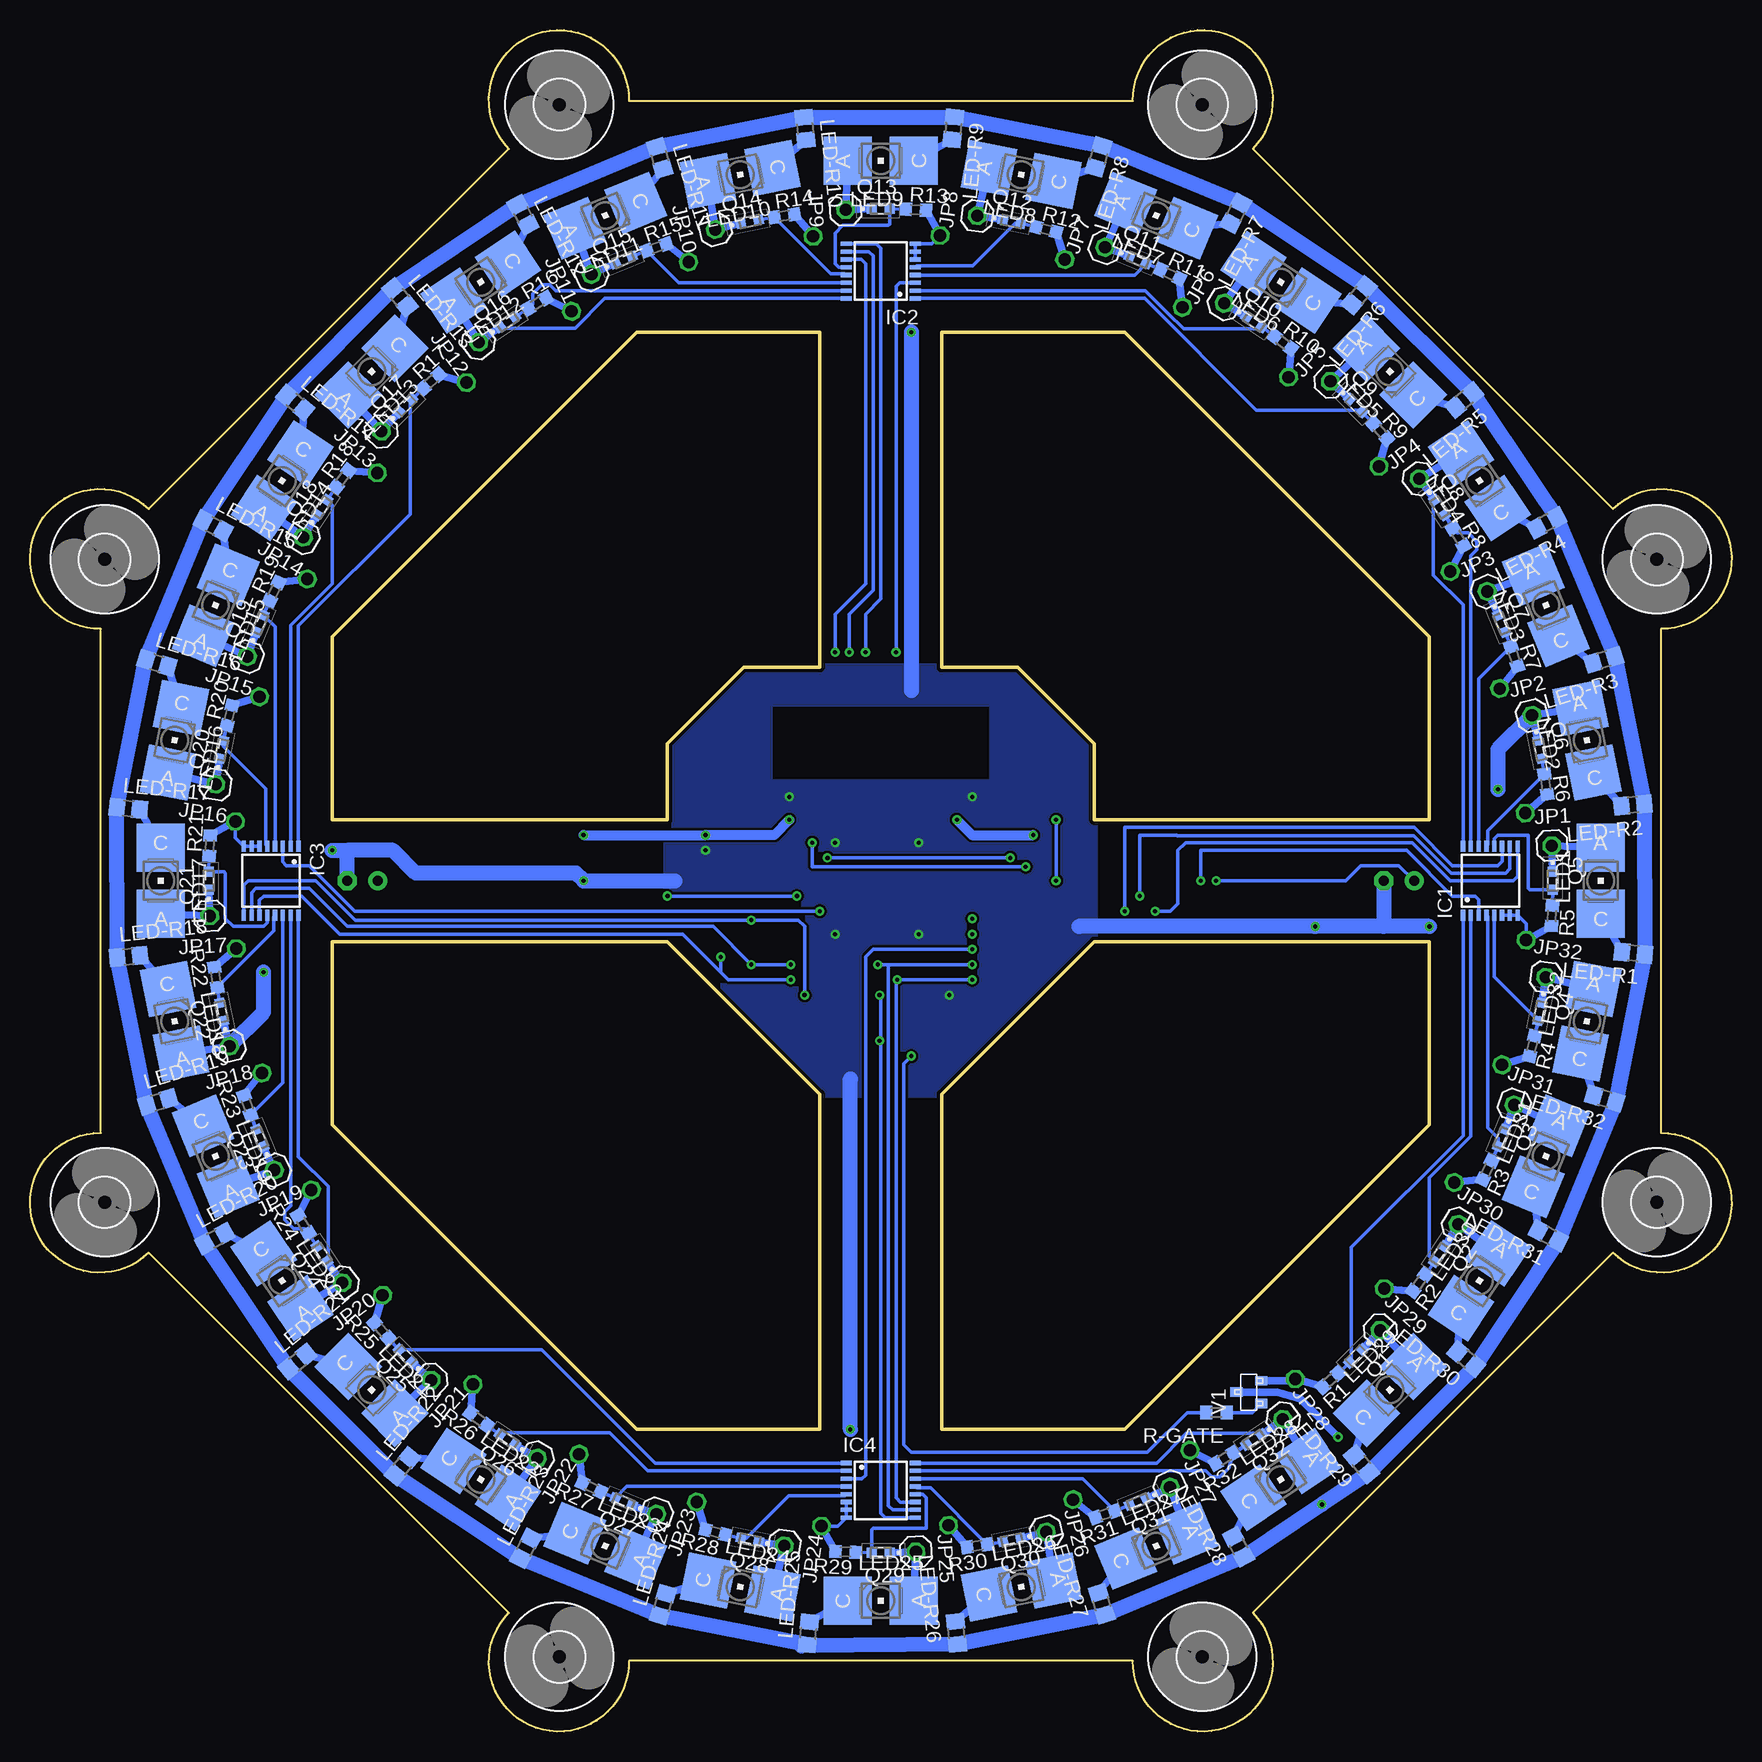
[diagram p4: board, bottom side, seen from below]

Size 141.8 x 141.8 mm. Coordinates in mm from the lower left corner, seen from the top.
Outline: 135.9,49.9 135.9,91.9 arc225 131.9,101.9 101.9,131.9 arc225 91.9,135.9 49.9,135.9 arc225 39.9,131.9 9.9,101.9 arc225 5.9,91.9 5.9,49.9 arc225 9.9,39.9 39.9,9.9 arc225 49.9,5.9 91.9,5.9 arc225 101.9,9.9 131.9,39.9 arc225 135.9,49.9
Outline: 116.62,75.98 88.68,75.98 88.68,82.33 82.33,88.68 75.98,88.68 75.98,116.62 91.22,116.62 116.62,91.22 116.62,75.98
Outline: 116.62,65.82 88.68,65.82 75.98,53.12 75.98,25.18 91.22,25.18 116.62,50.58 116.62,65.82
Outline: 65.82,116.62 65.82,88.68 59.47,88.68 53.12,82.33 53.12,75.98 25.18,75.98 25.18,91.22 50.58,116.62 65.82,116.62
Outline: 65.82,25.18 50.58,25.18 25.18,50.58 25.18,65.82 53.12,65.82 65.82,53.12 65.82,25.18
Copper layers (1*16): Top 0.035mm / dielectric 1.5mm / Bottom 0.035mm
Design rules "Normal-Pitch 2Layer *": minimum track width 8mil, minimum drill 8mil, track to track 8mil, track to pad 8mil, pad to pad 8mil, via to via 8mil, smd to smd 8mil, copper to edge 10mil, drill to drill 8mil, minimum pad ring 10mil, minimum via ring 8mil, stop-mask expansion 0mil, vias tented up to drill 0mil, thermal gap 10mil

### Footprints (pad centres in the part's own frame; a part is rotated, then mirrored left to right if it is on the bottom)
E2,5-6E = drill 0.813 pad 1.575: + -1.27,0 | drill 0.813 pad 1.575 octagon: - 1.27,0
0805 = smd 0.864 x 1.397: 1 -0.953,0; 2 0.953,0
R0603 = smd 1 x 1.1: 1 -0.85,0; 2 0.85,0
4,1 = hole 4.1: 0,0
TSSOP-16 = smd 0.9 x 0.35: 1 -2.875,2.275; 2 -2.875,1.625; 3 -2.875,0.975; 4 -2.875,0.325; 5 -2.875,-0.325; 6 -2.875,-0.975; 7 -2.875,-1.625; 8 -2.875,-2.275; 9 2.875,-2.275; 10 2.875,-1.625; 11 2.875,-0.975; 12 2.875,-0.325; 13 2.875,0.325; 14 2.875,0.975; 15 2.875,1.625; 16 2.875,2.275
1X01 = drill 1.016 octagon: 1 0,0
P-LCC-2 = smd 4 x 4: A 0,2.75; C 0,-2.75
R0805 = smd 1.3 x 1.5: 1 -0.95,0; 2 0.95,0
ALSPT19315CL177TR8 = smd 0.8 x 0.8: 1 -0.75,0; 2 0.75,0
ESP-WROOM-32 = smd 1.5 x 1: 1 -9.25,7; 2 -9.25,5.73; 3 -9.25,4.46; 4 -9.25,3.19; 5 -9.25,1.92; 6 -9.25,0.65; 7 -9.25,-0.62; 8 -9.25,-1.89; 9 -9.25,-3.16; 10 -9.25,-4.43; 11 -9.25,-5.7; 12 -9.25,-6.97; 13 -9.25,-8.24; 14 -9.25,-9.51; 25 9.25,-9.51; 26 9.25,-8.24; 27 9.25,-6.97; 28 9.25,-5.7; 29 9.25,-4.43; 30 9.25,-3.16; 31 9.25,-1.89; 32 9.25,-0.62; 33 9.25,0.65; 34 9.25,1.92; 35 9.25,3.19; 36 9.25,4.46; 37 9.25,5.73; 38 9.25,7 | smd 1 x 1.5: 15 -5.7,-11.25; 16 -4.43,-11.25; 17 -3.16,-11.25; 18 -1.89,-11.25; 19 -0.62,-11.25; 20 0.65,-11.25; 21 1.92,-11.25; 22 3.19,-11.25; 23 4.46,-11.25; 24 5.73,-11.25 | smd 6 x 6: GND 0.3,-0.7
SOT23 = smd 0.762 x 1.016: D 0,1.027; G -0.95,-1.027; S 0.95,-1.027
SO08 = smd 0.66 x 2.032: 1 -1.905,-3.073; 2 -0.635,-3.073; 3 0.635,-3.073; 4 1.905,-3.073; 5 1.905,3.073; 6 0.635,3.073; 7 -0.635,3.073; 8 -1.905,3.073
MOLEX104078-0610 = smd 0.8 x 1.3: P$1 -3.125,2; P$2 -1.875,2; P$3 -0.625,2; P$4 0.625,2; P$5 1.875,2; P$6 3.125,2 | smd 1.3 x 2.3: P$7 -6,0; P$8 6,0

### Placement (x,y rotation side)
C4  27.72,70.9 0 top
C5  114.08,70.9 0 top
C37  60.99,80.74 270 top
CANTERM  103.92,72.8 0 top
H1  MOUNT-HOLE4.1  [4,1]  6.23,97.69 22.5 bottom
H2  MOUNT-HOLE4.1  [4,1]  44.11,6.23 22.5 bottom
H3  MOUNT-HOLE4.1  [4,1]  135.57,44.11 22.5 bottom
H4  MOUNT-HOLE4.1  [4,1]  44.11,135.57 0 bottom
H5  97.69,135.57 22.5 bottom
H6  MOUNT-HOLE4.1  [4,1]  6.23,44.11 337.5 bottom
H7  MOUNT-HOLE4.1  [4,1]  97.69,6.23 337.5 bottom
H8  MOUNT-HOLE4.1  [4,1]  135.57,97.69 0 bottom
IC1  20.1,70.9 90 bottom
IC2  70.9,121.7 180 bottom
IC3  121.7,70.9 270 bottom
IC4  70.9,20.1 0 bottom
JP1  14.97,73.83 3 bottom
JP2  16.62,84.68 14.2 bottom
JP3  20.35,95.01 25.5 bottom
JP4  26.03,104.4 36.7 bottom
JP5  33.43,112.51 48 bottom
JP6  42.27,119.02 59.2 bottom
JP7  52.2,123.69 70.5 bottom
JP8  62.86,126.32 81.7 bottom
JP9  73.83,126.82 93 bottom
JP10  84.68,125.17 104.2 bottom
JP11  95.01,121.44 115.5 bottom
JP12  104.4,115.77 126.7 bottom
JP13  112.51,108.37 138 bottom
JP14  119.02,99.53 149.2 bottom
JP15  123.69,89.59 160.5 bottom
JP16  126.32,78.93 171.7 bottom
JP17  126.82,67.97 183 bottom
JP18  125.17,57.11 194.2 bottom
JP19  121.44,46.79 205.5 bottom
JP20  115.77,37.39 216.7 bottom
JP21  108.37,29.28 228 bottom
JP22  99.53,22.77 239.2 bottom
JP23  89.59,18.11 250.5 bottom
JP24  78.93,15.48 261.7 bottom
JP25  67.97,14.97 273 bottom
JP26  57.11,16.62 284.2 bottom
JP27  46.79,20.35 295.5 bottom
JP28  37.39,26.03 306.7 bottom
JP29  29.28,33.43 318 bottom
JP30  22.77,42.27 329.2 bottom
JP31  18.11,52.2 340.5 bottom
JP32  15.48,62.86 351.7 bottom
JP33  124.6,65.25 354 top
JP34  124.67,75.84 5.3 top
JP35  122.67,86.23 16.5 top
JP36  118.69,96.04 27.8 top
JP37  112.86,104.88 39 top
JP38  105.43,112.42 50.3 top
JP39  96.66,118.35 61.5 top
JP40  86.91,122.47 72.8 top
JP41  76.54,124.6 84 top
JP42  65.96,124.67 95.3 top
JP43  55.56,122.67 106.5 top
JP44  45.75,118.69 117.8 top
JP45  36.91,112.86 129 top
JP46  29.38,105.43 140.3 top
JP47  23.44,96.66 151.5 top
JP48  19.33,86.91 162.8 top
JP49  17.19,76.54 174 top
JP50  17.12,65.96 185.3 top
JP51  19.12,55.56 196.5 top
JP52  23.11,45.75 207.8 top
JP53  28.93,36.91 219 top
JP54  36.37,29.38 230.3 top
JP55  45.13,23.44 241.5 top
JP56  54.88,19.33 252.8 top
JP57  65.25,17.19 264 top
JP58  75.84,17.12 275.3 top
JP59  86.23,19.12 286.5 top
JP60  96.04,23.11 297.8 top
JP61  104.88,28.93 309 top
JP62  112.42,36.37 320.3 top
JP63  118.35,45.13 331.5 top
JP64  122.47,54.88 342.8 top
LED1  10.9,70.9 0 bottom
LED2  12.05,82.6 11.3 bottom
LED3  15.46,93.86 22.5 bottom
LED4  21.01,104.23 33.8 bottom
LED5  28.47,113.32 45 bottom
LED6  37.56,120.79 56.3 bottom
LED7  47.94,126.33 67.5 bottom
LED8  59.19,129.74 78.8 bottom
LED9  70.9,130.9 90 bottom
LED10  82.6,129.74 101.3 bottom
LED11  93.86,126.33 112.5 bottom
LED12  104.23,120.79 123.8 bottom
LED13  113.32,113.32 135 bottom
LED14  120.79,104.23 146.3 bottom
LED15  126.33,93.86 157.5 bottom
LED16  129.74,82.6 168.8 bottom
LED17  130.9,70.9 180 bottom
LED18  129.74,59.19 191.3 bottom
LED19  126.33,47.94 202.5 bottom
LED20  120.79,37.56 213.8 bottom
LED21  113.32,28.47 225 bottom
LED22  104.23,21.01 236.3 bottom
LED23  93.86,15.46 247.5 bottom
LED24  82.6,12.05 258.8 bottom
LED25  70.9,10.9 270 bottom
LED26  59.19,12.05 281.3 bottom
LED27  47.94,15.46 292.5 bottom
LED28  37.56,21.01 303.8 bottom
LED29  28.47,28.47 315 bottom
LED30  21.01,37.56 326.3 bottom
LED31  15.46,47.94 337.5 bottom
LED32  12.05,59.19 348.8 bottom
LED-R1  8.19,64.86 174.5 bottom
LED-R2  8.21,77.21 185.7 bottom
LED-R3  10.65,89.32 197 bottom
LED-R4  15.4,100.72 208.2 bottom
LED-R5  22.29,110.97 219.5 bottom
LED-R6  31.04,119.68 230.7 bottom
LED-R7  41.32,126.52 242 bottom
LED-R8  52.74,131.22 253.2 bottom
LED-R9  64.86,133.61 264.5 bottom
LED-R10  77.21,133.58 275.7 bottom
LED-R11  89.32,131.14 287 bottom
LED-R12  100.72,126.39 298.2 bottom
LED-R13  110.97,119.51 309.5 bottom
LED-R14  119.68,110.76 320.7 bottom
LED-R15  126.52,100.47 332 bottom
LED-R16  131.22,89.05 343.2 bottom
LED-R17  133.61,76.94 354.5 bottom
LED-R18  133.58,64.59 5.7 bottom
LED-R19  131.14,52.48 17 bottom
LED-R20  126.39,41.08 28.2 bottom
LED-R21  119.51,30.82 39.5 bottom
LED-R22  110.76,22.11 50.7 bottom
LED-R23  100.47,15.27 62 bottom
LED-R24  89.05,10.57 73.2 bottom
LED-R25  76.94,8.19 84.5 bottom
LED-R26  64.59,8.21 95.7 bottom
LED-R27  52.48,10.65 107 bottom
LED-R28  41.08,15.4 118.2 bottom
LED-R29  30.82,22.29 129.5 bottom
LED-R30  22.11,31.04 140.7 bottom
LED-R31  15.27,41.32 152 bottom
LED-R32  10.57,52.74 163.2 bottom
Q1  31.3,31.3 225 bottom
Q2  24.34,39.79 236.3 bottom
Q3  19.16,49.47 247.5 bottom
Q4  15.97,59.97 258.8 bottom
Q5  14.9,70.9 270 bottom
Q6  15.97,81.82 281.3 bottom
Q7  19.16,92.33 292.5 bottom
Q8  24.34,102.01 303.8 bottom
Q9  31.3,110.5 315 bottom
Q10  39.79,117.46 326.3 bottom
Q11  49.47,122.63 337.5 bottom
Q12  59.97,125.82 348.8 bottom
Q13  70.9,126.9 0 bottom
Q14  81.82,125.82 11.3 bottom
Q15  92.33,122.63 22.5 bottom
Q16  102.01,117.46 33.8 bottom
Q17  110.5,110.5 45 bottom
Q18  117.46,102.01 56.3 bottom
Q19  122.63,92.33 67.5 bottom
Q20  125.82,81.82 78.8 bottom
Q21  126.9,70.9 90 bottom
Q22  125.82,59.97 101.3 bottom
Q23  122.63,49.47 112.5 bottom
Q24  117.46,39.79 123.8 bottom
Q25  110.5,31.3 135 bottom
Q26  102.01,24.34 146.3 bottom
Q27  92.33,19.16 157.5 bottom
Q28  81.82,15.97 168.8 bottom
Q29  70.9,14.9 180 bottom
Q30  59.97,15.97 191.3 bottom
Q31  49.47,19.16 202.5 bottom
Q32  39.79,24.34 213.8 bottom
R1  33.43,29.28 222 bottom
R2  26.03,37.39 233.3 bottom
R3  20.35,46.79 244.5 bottom
R4  16.62,57.11 255.8 bottom
R5  14.97,67.97 267 bottom
R6  15.48,78.93 278.3 bottom
R7  18.11,89.59 289.5 bottom
R8  22.77,99.53 300.8 bottom
R9  29.28,108.37 312 bottom
R10  37.39,115.77 323.3 bottom
R11  46.79,121.44 334.5 bottom
R12  57.11,125.17 345.8 bottom
R13  67.97,126.82 357 bottom
R14  78.93,126.32 8.3 bottom
R15  89.59,123.69 19.5 bottom
R16  99.53,119.02 30.8 bottom
R17  108.37,112.51 42 bottom
R18  115.77,104.4 53.3 bottom
R19  121.44,95.01 64.5 bottom
R20  125.17,84.68 75.8 bottom
R21  126.82,73.83 87 bottom
R22  126.32,62.86 98.3 bottom
R23  123.69,52.2 109.5 bottom
R24  119.02,42.27 120.8 bottom
R25  112.51,33.43 132 bottom
R26  104.4,26.03 143.3 bottom
R27  95.01,20.35 154.5 bottom
R28  84.68,16.62 165.8 bottom
R29  73.83,14.97 177 bottom
R30  62.86,15.48 188.3 bottom
R31  52.2,18.11 199.5 bottom
R32  42.27,22.77 210.8 bottom
R-ENA  61.04,84.43 270 top
R-GATE  42.94,26.58 180 bottom
U1  70.9,70.9 0 top
V1  40.23,28.29 90 bottom
V2  90.46,72.8 270 top
X1  103.92,67.72 0 top
X3  38.13,67.72 0 top

### Tracks (layer width: path | path; a pad name or v marks a point on that pad's centre or on a via)
+3V3  (via drill 0.35)
  Top 0.305: U1.2 60.09,76.63 59.47,77.25 59.47,81.69 60.1,82.33 60.74,82.33 | 60.74,82.33 60.99,82.07 C37.1 | 60.74,82.33 61.04,82.63 R-ENA.2 | X3.P$6 42.43,70.9 v42.96,70.9
  Top 0.61: V2.3 84.87,72.17 84.23,72.8 84.23,74.07 84.87,74.71 v85.5,74.71
  Top 0.813: X1.P$5 105.79,71.5 106.46,72.17 106.46,74.66 106.51,74.71 | 106.51,74.71 109,74.71 C5.+ | 106.51,74.71 v95.66,74.71 | 26.45,74.71 v58.2,74.71 | v78.52,75.98 v64.55,75.98 63.9,76.63 U1.2
  Top 1.27: v122.33,63.28 117.25,68.36 112.81,68.36 C5.+ | v19.46,78.52 23.27,74.71 26.45,74.71 C4.+ | JP8.1 JP7.1 JP6.1 JP5.1 JP4.1 JP3.1 JP2.1 JP1.1 JP32.1 JP31.1 JP30.1 JP29.1 JP28.1 JP27.1 JP26.1 JP25.1 JP24.1 JP23.1 JP22.1 JP21.1 JP20.1 JP19.1 JP18.1 JP17.1 JP16.1 JP15.1 JP14.1 JP13.1 JP12.1 JP11.1 JP10.1 JP9.1 JP8.1
  Bottom 0.305: IC2.16 93.89,119.42 96.37,116.94 102.91,116.94 103.26,116.59 | IC3.16 119.42,47.9 116.94,45.42 116.94,38.89 116.59,38.53 | IC4.16 47.9,22.37 45.42,24.85 38.89,24.85 38.53,25.21 | IC1.16 22.37,93.89 24.85,96.37 24.85,102.91 25.21,103.26 | v42.96,70.9 32.16,70.9 30.89,72.17 27.72,72.17 C4.+
  Bottom 0.61: LED9.A JP9.1 Q13.1 | LED8.A JP8.1 Q12.1 | LED7.A JP7.1 Q11.1 | LED6.A JP6.1 Q10.1 | LED5.A JP5.1 Q9.1 | LED4.A JP4.1 25.21,103.26 Q8.1 | LED3.A JP3.1 Q7.1 | LED2.A JP2.1 Q6.1 | LED1.A JP1.1 Q5.1 | LED32.A JP32.1 Q4.1 | LED31.A JP31.1 Q3.1 | LED30.A JP30.1 Q2.1 | LED29.A JP29.1 Q1.1 | LED28.A JP28.1 38.53,25.21 Q32.1 | LED27.A JP27.1 Q31.1 | LED26.A JP26.1 Q30.1 | LED25.A JP25.1 Q29.1 | LED24.A JP24.1 Q28.1 | LED23.A JP23.1 Q27.1 | LED22.A JP22.1 Q26.1 | LED21.A JP21.1 Q25.1 | LED20.A JP20.1 116.59,38.53 Q24.1 | LED19.A JP19.1 Q23.1 | LED18.A JP18.1 Q22.1 | LED17.A JP17.1 Q21.1 | LED16.A JP16.1 Q20.1 | LED15.A JP15.1 Q19.1 | LED14.A 119.08,99.57 | 119.08,99.57 JP14.1 | LED13.A JP13.1 Q17.1 | LED12.A JP12.1 103.26,116.59 Q16.1 | LED11.A JP11.1 Q15.1 | LED10.A JP10.1 Q14.1 | Q18.1 119.08,99.57
  Bottom 0.813: v95.66,74.71 v85.5,74.71 79.79,74.71 v78.52,75.98 | v64.55,75.98 63.28,74.71 v58.2,74.71
  Bottom 1.27: JP18.1 122.33,59.95 v122.33,63.28 | JP2.1 19.46,81.84 v19.46,78.52
A1  (via drill 0.35)
  Top 0.305: U1.16 66.47,60.1 66.45,60.09 66.45,57.56 | v71,57.56 66.45,57.56 | v48.04,68.36 49.31,67.09 54.39,67.09 60.1,61.37 60.1,60.74 63.28,57.56 66.45,57.56 | v77.25,61.37 v71,61.37 | v72.17,89.95 72.17,86.77 72.8,86.14 80.42,86.14 81.69,84.87 v81.69,67.62
  Bottom 0.305: IC2.9 71.27,123.97 70.9,123.6 70.9,94.39 72.17,93.12 v72.17,89.95 | IC3.9 123.97,70.53 123.6,70.9 117.97,70.9 114.7,67.62 v81.69,67.62 77.78,67.62 77.25,67.09 v77.25,61.37 | IC4.9 70.53,17.82 70.9,18.19 70.9,57.56 | IC1.9 17.82,71.27 18.19,70.9 23.44,70.9 26.61,74.07 45.5,74.07 46.13,73.44 46.13,68.99 46.77,68.36 v48.04,68.36 | 70.9,57.56 v71,57.56 | v71,61.37 70.9,61.27 70.9,57.56
A2  (via drill 0.35)
  Top 0.305: v63.28,63.91 63.26,63.93 U1.12 60.72,63.93 55.02,69.63 v49.31,69.63 | v71.15,63.91 v78.39,63.91 | v73.54,89.95 73.54,87.31 74.07,86.77 81.06,86.77 82.33,85.5 82.33,69.63 82.96,68.99 82.96,66.45 81.69,65.18 v81.69,63.91
  Bottom 0.305: IC2.10 71.89,123.32 71.53,122.97 71.53,95.13 73.54,93.12 v73.54,89.95 | IC3.10 123.32,69.91 122.97,70.26 118.52,70.26 115.35,67.09 84.87,67.09 v81.69,63.91 v78.39,63.91 | IC4.10 69.91,18.47 70.26,18.83 70.26,63.91 | IC1.10 18.47,71.89 18.83,71.53 23.36,71.53 26.49,74.67 46.17,74.67 46.22,74.71 49.31,74.71 v49.31,69.63 | 70.26,63.91 v63.28,63.91 | 70.26,63.91 v71.15,63.91
A3  (via drill 0.35)
  Top 0.305: v63.28,62.64 63.26,62.66 U1.13 60.75,62.66 55.05,68.36 v50.58,68.36 | v78.39,62.64 v69.53,62.64 | v74.71,89.95 74.71,88.04 75.34,87.41 81.69,87.41 82.96,86.14 82.96,70.26 84.23,68.99 v84.23,64.55
  Bottom 0.305: IC2.11 72.51,122.67 72.17,122.33 72.17,95.66 74.71,93.12 v74.71,89.95 | IC3.11 122.67,69.29 122.33,69.63 119.16,69.63 115.98,66.45 87.41,66.45 84.23,63.28 | IC4.11 69.29,19.12 69.63,19.46 69.63,62.64 v69.53,62.64 v63.28,62.64 | IC1.11 19.12,72.51 19.46,72.17 23.27,72.17 26.45,75.34 50.58,75.34 v50.58,68.36 | v78.39,62.64 83.6,62.64 83.92,62.96 84.23,63.28 | v84.23,64.55 84.23,63.28
D1  (via drill 0.35)
  Top 0.305: U1.8 58.18,69.01 v56.29,70.9 | v56.29,75.98 56.29,76.61 58.3,78.62 58.3,82.81 59.47,83.98 59.47,86.14 60.1,86.77 68.99,86.77 69.63,87.41 v69.63,89.95
  Bottom 0.305: IC2.3 69.33,120.72 69.63,120.43 v69.63,89.95 | v56.29,70.9 v56.29,75.98
D2  (via drill 0.35)
  Top 0.305: v63.28,67.72 63.26,67.74 U1.9 58.18,67.74 55.02,70.9 v44.23,70.9
  Bottom 0.305: IC1.3 21.07,69.33 21.37,69.63 23.27,69.63 27.08,73.44 44.23,73.44 v44.23,70.9
D3  (via drill 0.35)
  Top 0.305: U1.10 63.26,66.47 | 63.26,66.47 v63.28,66.45 | v75.98,68.36 75.98,65.18 65.18,65.18 63.9,66.47 63.26,66.47
  Bottom 0.305: IC3.3 120.72,72.46 120.43,72.17 118.52,72.17 114.71,68.36 v75.98,68.36
D4  (via drill 0.35)
  Top 0.305: U1.11 63.26,65.2 v63.28,65.18
  Bottom 0.305: IC4.3 72.46,21.07 72.17,21.37 72.17,64.55 71.53,65.18 v63.28,65.18
GND  (via drill 0.35)
  Top 0.305: 35.01,67.39 v34.7,67.09 | V2.5 93.12,70.9 92.49,70.9 91.85,71.53 91.85,74.71 V2.8 | V2.2 v85.5,73.44
  Top 0.61: v63.28,77.88 63.26,77.9 U1.1 60.99,78.55 C37.2 | U1.GND 67.72,73.67 v67.72,74.07 | U1.GND 74.71,73.71 v74.71,74.07 | U1.GND 67.72,66.72 v67.72,66.45 | U1.GND 74.71,66.69 v74.71,66.45 | U1.15 65.18,59.66 v65.18,61.37 | U1.38 80.13,77.88 v78.52,77.88 | X3.P$1 35.01,67.39
  Top 0.813: X1.P$2 102.01,69.75 102.01,70.9 100.74,70.9 | X1.P$1 100.74,69.77 100.74,70.9 | 100.74,70.9 v95.66,70.9 93.12,70.9
  Top 1.27: JP34.1 JP35.1 JP36.1 JP37.1 JP38.1 JP39.1 JP40.1 JP41.1 JP42.1 | JP34.1 JP33.1 JP64.1 JP63.1 JP62.1 JP61.1 JP60.1 JP59.1 JP58.1 | JP58.1 JP57.1 JP56.1 JP55.1 JP54.1 JP53.1 JP52.1 JP51.1 JP50.1 | JP50.1 JP49.1 JP48.1 JP47.1 JP46.1 JP45.1 JP44.1 JP43.1 JP42.1 | JP42.1 68.36,122.27 v68.36,116.62 | JP34.1 122.27,73.44 v116.62,73.44 | JP58.1 73.44,19.53 v73.44,25.18 | JP50.1 18.26,67.09 v25.18,67.09
  Bottom 0.305: JP42.1 66.65,123.97 IC2.8 IC2.7 IC2.6 | IC4.6 IC4.7 IC4.8 74.47,17.12 JP58.1 | IC1.6 IC1.7 IC1.8 17.12,67.32 JP50.1 | IC3.6 IC3.7 IC3.8 124.67,74.47 JP34.1
  Bottom 0.61: R15.2 JP40.1 | R16.2 JP39.1 | R17.2 JP38.1 | R18.2 JP37.1 | R19.2 JP36.1 | R20.2 JP35.1 | R21.2 JP34.1 | R22.2 JP33.1 | R23.2 JP64.1 | R24.2 JP63.1 | R25.2 JP62.1 | R26.2 JP61.1 | R27.2 JP60.1 | R28.2 JP59.1 | R29.2 JP58.1 | R30.2 JP57.1 | R31.2 JP56.1 | R1.2 JP54.1 36.51,29.24 V1.S | R2.2 JP53.1 | R3.2 JP52.1 | R4.2 JP51.1 | R5.2 JP50.1 | R6.2 JP49.1 | R7.2 JP48.1 | R8.2 JP47.1 | R9.2 JP46.1 | R10.2 JP45.1 | R11.2 JP44.1 | R12.2 JP43.1 | R13.2 JP42.1 | R14.2 JP41.1 | R32.2 JP55.1
  Bottom 1.27: v25.18,67.09 28.99,67.09 | 28.99,67.09 v34.7,67.09 54.39,67.09 | v73.44,25.18 73.44,54.39 | v116.62,73.44 115.35,73.44 | v68.36,116.62 68.36,86.77 | C5.- 115.35,73.44 | C4.- 28.99,67.09 | 88.04,70.9 v95.66,70.9 96.3,71.53 109.63,71.53 111.54,73.44 115.35,73.44
  pour Bottom: 53.12,88.68 88.68,88.68 88.68,65.82 75.98,53.12 65.82,53.12 53.12,65.82
LED  (via drill 0.35)
  Top 0.61: v32.8,24.54 32.8,20.1 34.07,18.83 34.13,18.89 v34.13,18.93
  Bottom 0.305: 64.8,134.53 LED-R9.1 | 77.5,7.14 LED-R25.1
  Bottom 0.61: v32.8,24.54 32.8,24.57 35.95,27.72 37.88,28.29 V1.D
  Bottom 1.27: 64.8,134.53 LED-R10.1 LED-R11.1 LED-R12.1 LED-R13.1 LED-R14.1 LED-R15.1 LED-R16.1 LED-R17.1 LED-R18.1 LED-R19.1 LED-R20.1 LED-R21.1 LED-R22.1 LED-R23.1 LED-R24.1 LED-R25.1 | LED-R9.1 LED-R8.1 LED-R7.1 LED-R6.1 LED-R5.1 LED-R4.1 LED-R3.1 LED-R2.1 LED-R1.1 LED-R32.1 LED-R31.1 LED-R30.1 LED-R29.1 v34.13,18.93 LED-R28.1 LED-R27.1 LED-R26.1 77.5,7.14
LED-BASE
  Bottom 0.305: V1.G 39.96,26.58 R-GATE.1
LED-SCHALT  (via drill 0.35)
  Top 0.305: v68.36,56.29 75.98,56.29 76.63,56.94 U1.24
  Bottom 0.305: R-GATE.2 45.36,26.58 48.67,23.27 68.36,23.27 68.99,23.91 68.99,55.66 v68.36,56.29
N$1
  Bottom 0.61: LED-R5.2 LED5.C
N$2
  Bottom 0.61: LED-R6.2 LED6.C
N$3
  Bottom 0.61: LED-R7.2 LED7.C
N$4
  Bottom 0.61: LED-R8.2 LED8.C
N$5
  Bottom 0.61: LED-R9.2 LED9.C
N$6
  Bottom 0.61: LED10.C LED-R10.2
N$7
  Bottom 0.61: LED11.C LED-R11.2
N$8
  Bottom 0.61: LED12.C LED-R12.2
N$9
  Bottom 0.61: LED-R1.2 LED1.C
N$10
  Bottom 0.61: LED-R2.2 LED2.C
N$11
  Bottom 0.61: LED-R3.2 LED3.C
N$12
  Bottom 0.61: LED-R4.2 LED4.C
N$13
  Bottom 0.61: LED13.C LED-R13.2
N$14
  Bottom 0.61: LED14.C LED-R14.2
N$15
  Bottom 0.61: LED15.C LED-R15.2
N$16
  Bottom 0.61: LED16.C LED-R16.2
N$17
  Bottom 0.61: LED17.C LED-R17.2
N$18
  Bottom 0.61: LED18.C LED-R18.2
N$19
  Bottom 0.61: LED19.C LED-R19.2
N$20
  Bottom 0.61: LED20.C LED-R20.2
N$21
  Bottom 0.61: LED21.C LED-R21.2
N$22
  Bottom 0.61: LED22.C LED-R22.2
N$23
  Bottom 0.61: LED23.C LED-R23.2
N$24
  Bottom 0.61: LED24.C LED-R24.2
N$25
  Bottom 0.61: LED25.C LED-R25.2
N$26
  Bottom 0.61: LED26.C LED-R26.2
N$27
  Bottom 0.61: LED27.C LED-R27.2
N$28
  Bottom 0.61: LED28.C LED-R28.2
N$29
  Bottom 0.61: LED29.C LED-R29.2
N$30
  Bottom 0.61: LED30.C LED-R30.2
N$31
  Bottom 0.61: LED31.C LED-R31.2
N$32
  Bottom 0.61: LED32.C LED-R32.2
N$33
  Top 0.305: R-ENA.1 60.52,85.28 60.1,84.87 60.1,83.9 58.81,82.6 58.81,76.64 59.47,75.98 59.47,75.34 | X3.P$2 36.26,73.09 36.61,73.44 58.83,73.44 59.47,74.07 59.47,75.34 | U1.3 61.63,75.34 59.47,75.34
N$34
  Bottom 0.305: Q6.2 R6.1 17.67,77.7 20.3,75.07 20.3,73.89 IC1.13
N$35
  Top 0.305: X3.P$3 37.51,68.73 37.88,68.36 42.46,68.36 43.33,69.23 44.93,69.23 47.7,66.45 53.27,66.45 65.9,53.83 75.9,53.83 80.15,58.08 U1.25
N$36
  Bottom 0.305: Q23.2 R23.1 120.72,54.08 IC3.14
N$37
  Bottom 0.305: Q22.2 R22.1 124.12,64.09 121.49,66.72 121.49,67.9 IC3.13
N$38
  Bottom 0.305: R5.1 Q5.2 16.81,70.15 16.92,70.26 16.92,74.71 19.46,74.71 19.77,74.4 IC1.12
N$39
  Bottom 0.305: Q7.2 R7.1 21.07,87.71 IC1.14
N$40
  Bottom 0.305: Q8.2 R8.1 22.84,99.89 21.96,99.89 21.23,99.16 21.23,98.49 21.72,98 IC1.15
N$41
  Bottom 0.305: R21.1 Q21.2 125.62,71.65 125.51,71.53 125.51,67.72 124.87,67.09 122.33,67.09 122.02,67.4 IC3.12
N$42
  Bottom 0.305: R27.1 Q27.2 92.05,20.42 91.54,20.42 91.22,20.42 IC4.4
N$43
  Bottom 0.305: Q1.2 31.94,30.66 | 31.94,30.66 R1.1 | IC1.1 22.37,49.66 31.69,40.34 31.69,30.91 31.94,30.66
N$44
  Bottom 0.305: R4.1 Q4.2 19.77,62.89 IC1.5
N$45
  Bottom 0.305: R2.1 Q2.2 25.18,39.59 25.18,46.13 21.72,49.59 IC1.2
N$46
  Bottom 0.305: R3.1 Q3.2 19.45,49.45 20.32,50.33 20.32,67.92 IC1.4
N$47
  Bottom 0.305: Q16.2 R16.1 99.89,118.96 99.89,119.83 99.16,120.57 98.49,120.57 98,120.07 IC2.15
N$48
  Bottom 0.305: Q15.2 R15.1 87.71,120.72 IC2.14
N$49
  Bottom 0.305: Q14.2 R14.1 77.7,124.12 75.07,121.49 73.89,121.49 IC2.13
N$50
  Bottom 0.305: R13.1 Q13.2 70.15,125.62 70.26,125.51 74.07,125.51 74.71,124.87 74.71,122.33 74.4,122.02 IC2.12
N$51
  Bottom 0.305: R9.1 Q9.2 30.91,110.1 39.59,110.1 48.91,119.42 IC2.1
N$52
  Bottom 0.305: R12.1 Q12.2 59.68,125.68 63.21,122.14 67.9,122.14 IC2.5
N$53
  Bottom 0.305: R11.1 Q11.2 49.75,121.37 IC2.4
N$54
  Bottom 0.305: Q10.2 38.95,116.9 | 38.95,116.9 R10.1 | IC2.2 48.84,120.07 46.4,117.62 46.25,117.48 45.67,116.9 38.95,116.9
N$55
  Bottom 0.305: Q24.2 R24.1 118.96,41.9 119.83,41.9 120.57,42.64 120.57,43.3 120.07,43.8 IC3.15
N$56
  Bottom 0.305: Q26.2 102.84,24.9 | 102.84,24.9 R26.1 | IC4.2 90.3,21.72 93.48,24.9 102.84,24.9
N$58
  Bottom 0.305: R17.1 Q17.2 110.1,110.89 110.1,101.46 119.42,92.14 IC3.1
N$59
  Bottom 0.305: R20.1 Q20.2 125.68,82.11 122.14,78.58 122.14,73.89 IC3.5
N$60
  Bottom 0.305: R18.1 Q18.2 116.62,102.21 116.62,95.66 120.07,92.21 IC3.2
N$61
  Bottom 0.305: R19.1 Q19.2 121.37,92.05 IC3.4
N$62
  Bottom 0.305: IC4.15 43.8,21.72 43.3,21.23 42.64,21.23 41.9,21.96 R32.1 Q32.2
N$63
  Bottom 0.305: Q31.2 R31.1 54.08,21.07 IC4.14
N$64
  Bottom 0.305: Q30.2 61.38,15.71 | 61.38,15.71 R30.1 | IC4.13 67.9,20.3 66.72,20.3 62.13,15.71 61.38,15.71
N$65
  Bottom 0.305: R29.1 Q29.2 71.65,16.81 71.53,16.92 67.09,16.92 67.09,19.46 67.4,19.77 IC4.12
N$66
  Bottom 0.305: R25.1 Q25.2 99.14,31.83 89.68,22.37 IC4.1
N$67
  Bottom 0.305: R28.1 Q28.2 82.11,16.12 78.58,19.65 73.89,19.65 IC4.5
N$99
  Top 0.305: U1.26 84.25,62.66 87.41,65.82 87.41,70.87 V2.4
N$100  (via drill 0.35)
  Top 0.305: V2.1 89.31,74.71 89.95,74.07 89.95,70.26 89.31,69.63 v88.68,69.63 | U1.29 80.16,66.45 77.88,66.45 v77.88,69.63
  Bottom 0.305: v88.68,69.63 v77.88,69.63
N$101
  Top 0.305: X1.P$4 104.54,72.58 CANTERM.2 104.62,72.8 103.71,73.71 102.42,73.71 102.15,73.44 V2.7
N$102
  Top 0.305: X1.P$3 103.29,72.58 CANTERM.1 102.43,72.17 V2.6
RX  (via drill 0.35)
  Top 0.305: X3.P$4 38.51,69.97 38.51,72.17 39.15,72.8 v60.1,72.8 | v75.34,72.8 80.13,72.8 U1.34
  Bottom 0.305: v60.1,72.8 v75.34,72.8
TX  (via drill 0.35)
  Top 0.305: X3.P$5 40.01,71.76 40.42,72.17 58.83,72.17 v58.83,72.07 | v76.61,74.07 80.13,74.07 U1.35
  Bottom 0.305: v58.83,72.07 76.61,72.07 v76.61,74.07

### Text on the board
tNames: Bohlebots 2021 / Bodensensor Ver.35 | Bohlebots 2021 / Bodensensor Ver.35